# EAGLE design Čos - POC - rectifier and zero cross detector (EAGLE 9.6.2)
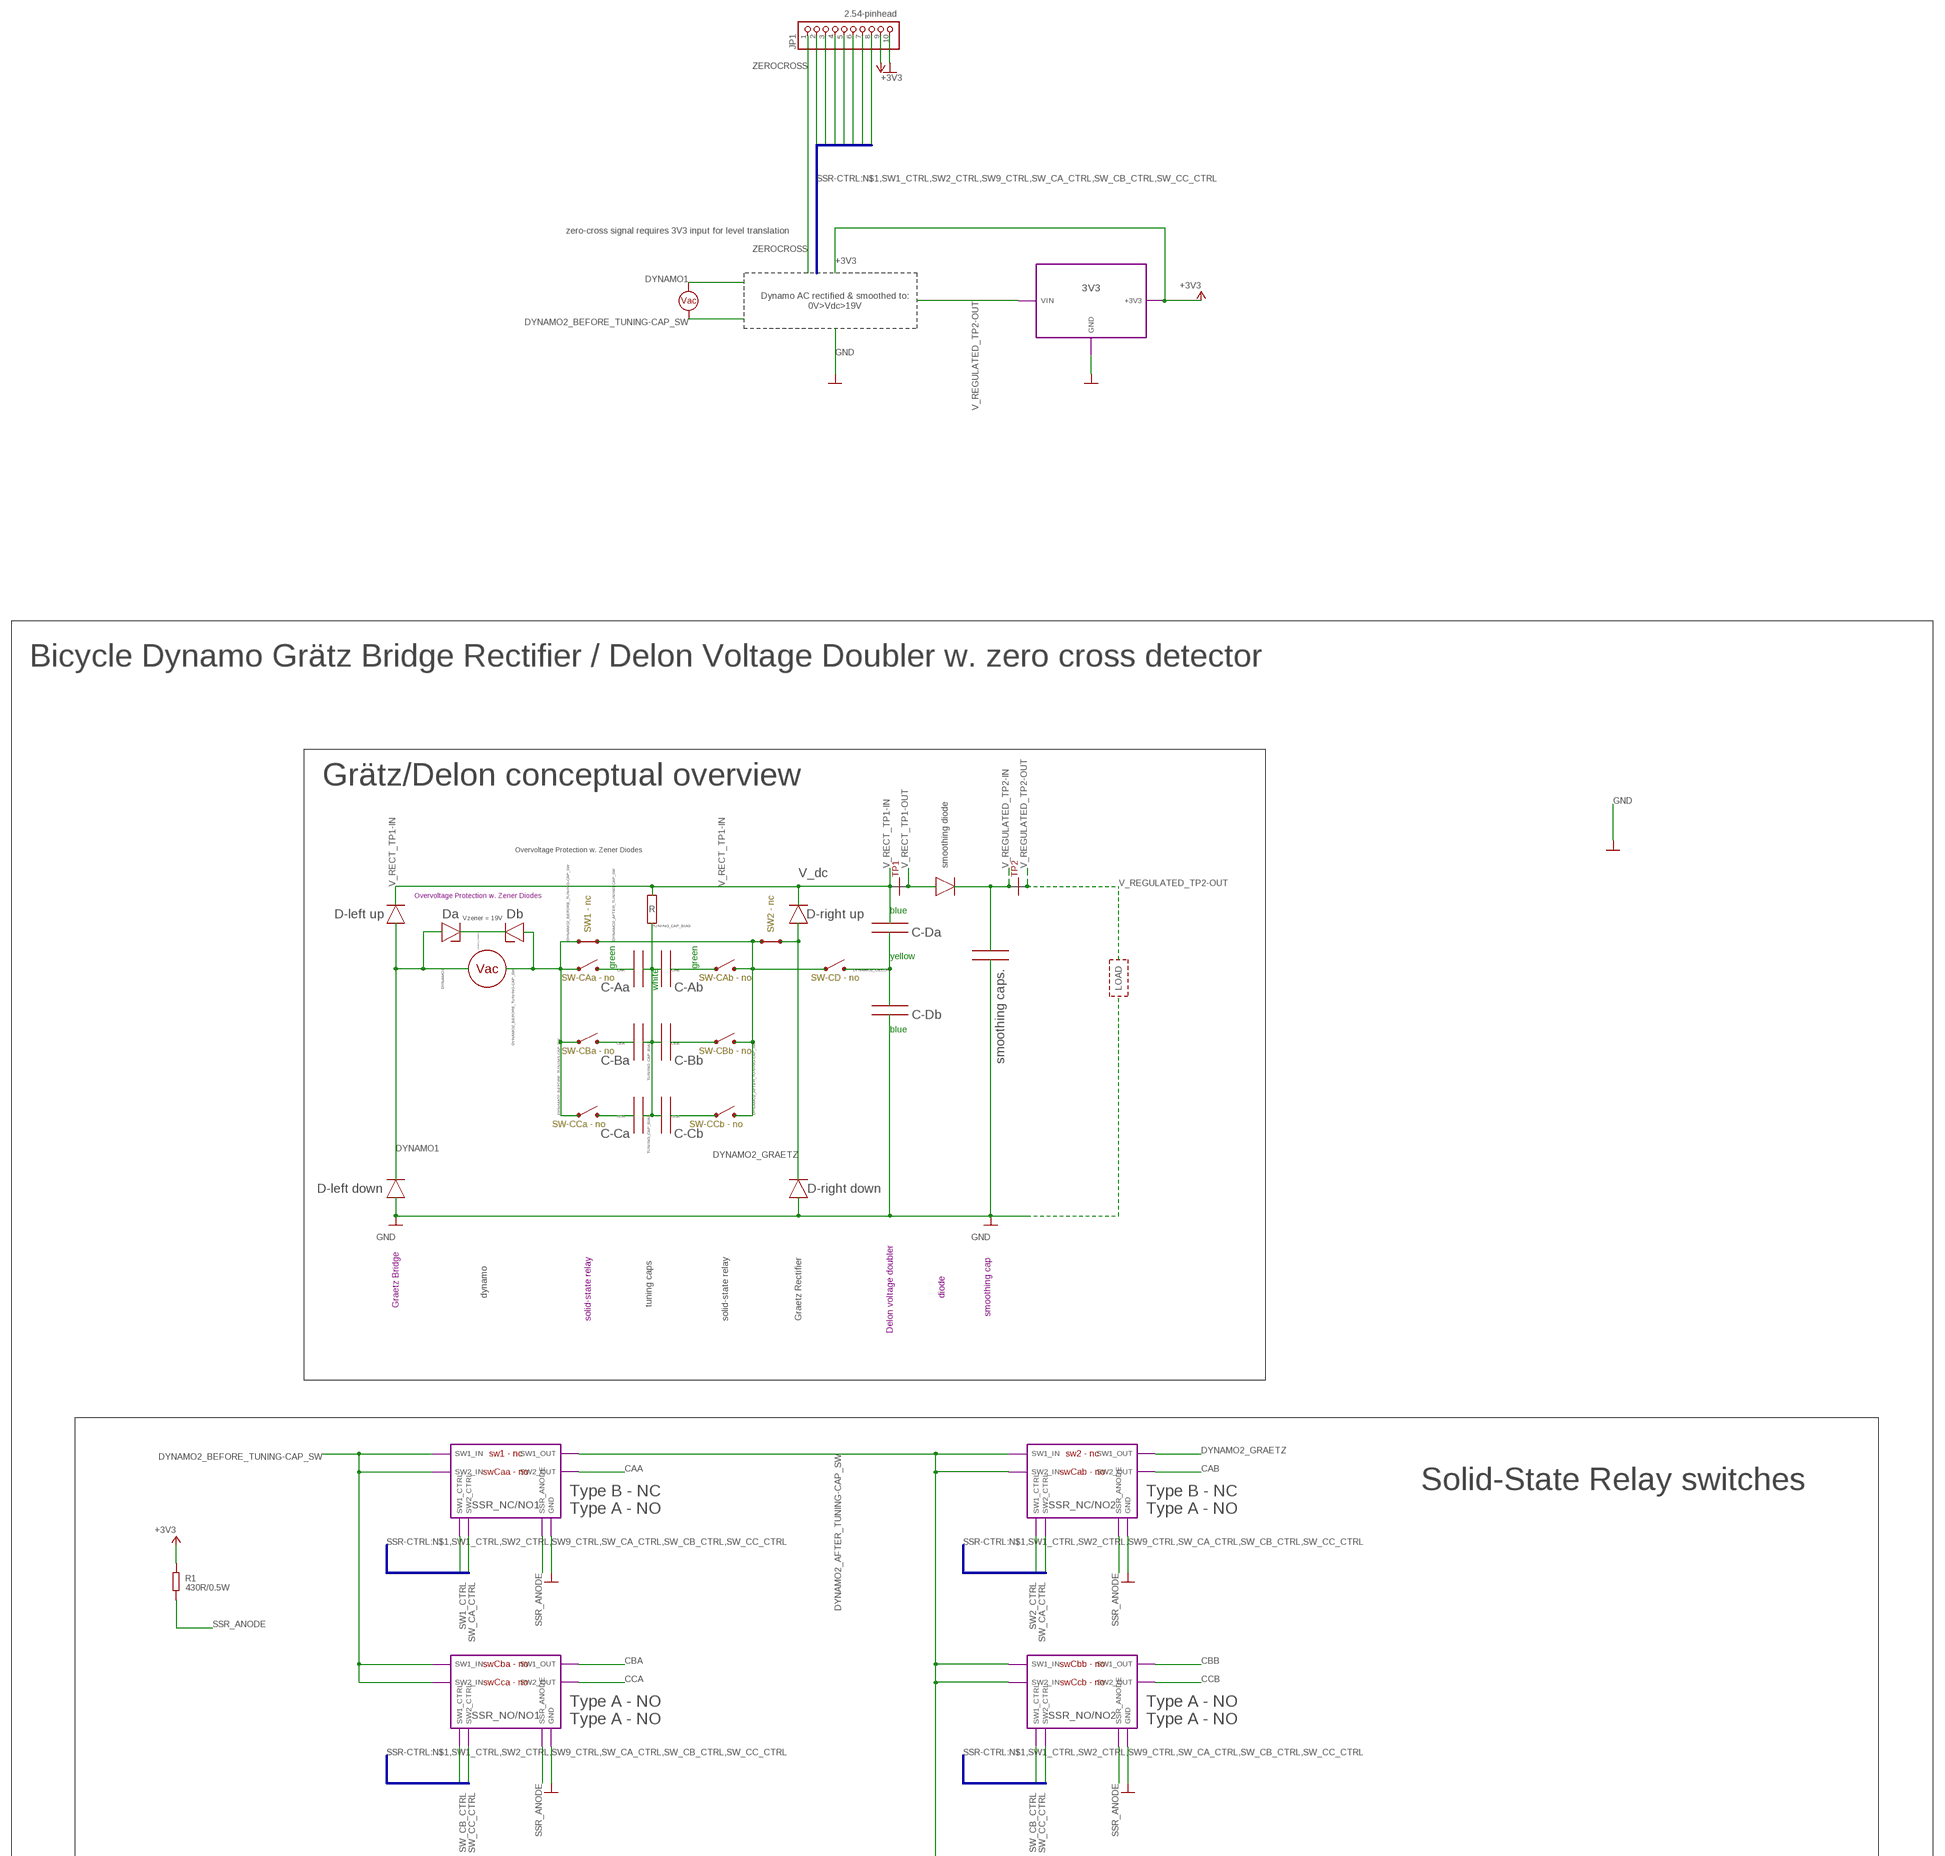
[diagram p0: schematic, sheet 1, part 1 of 3]
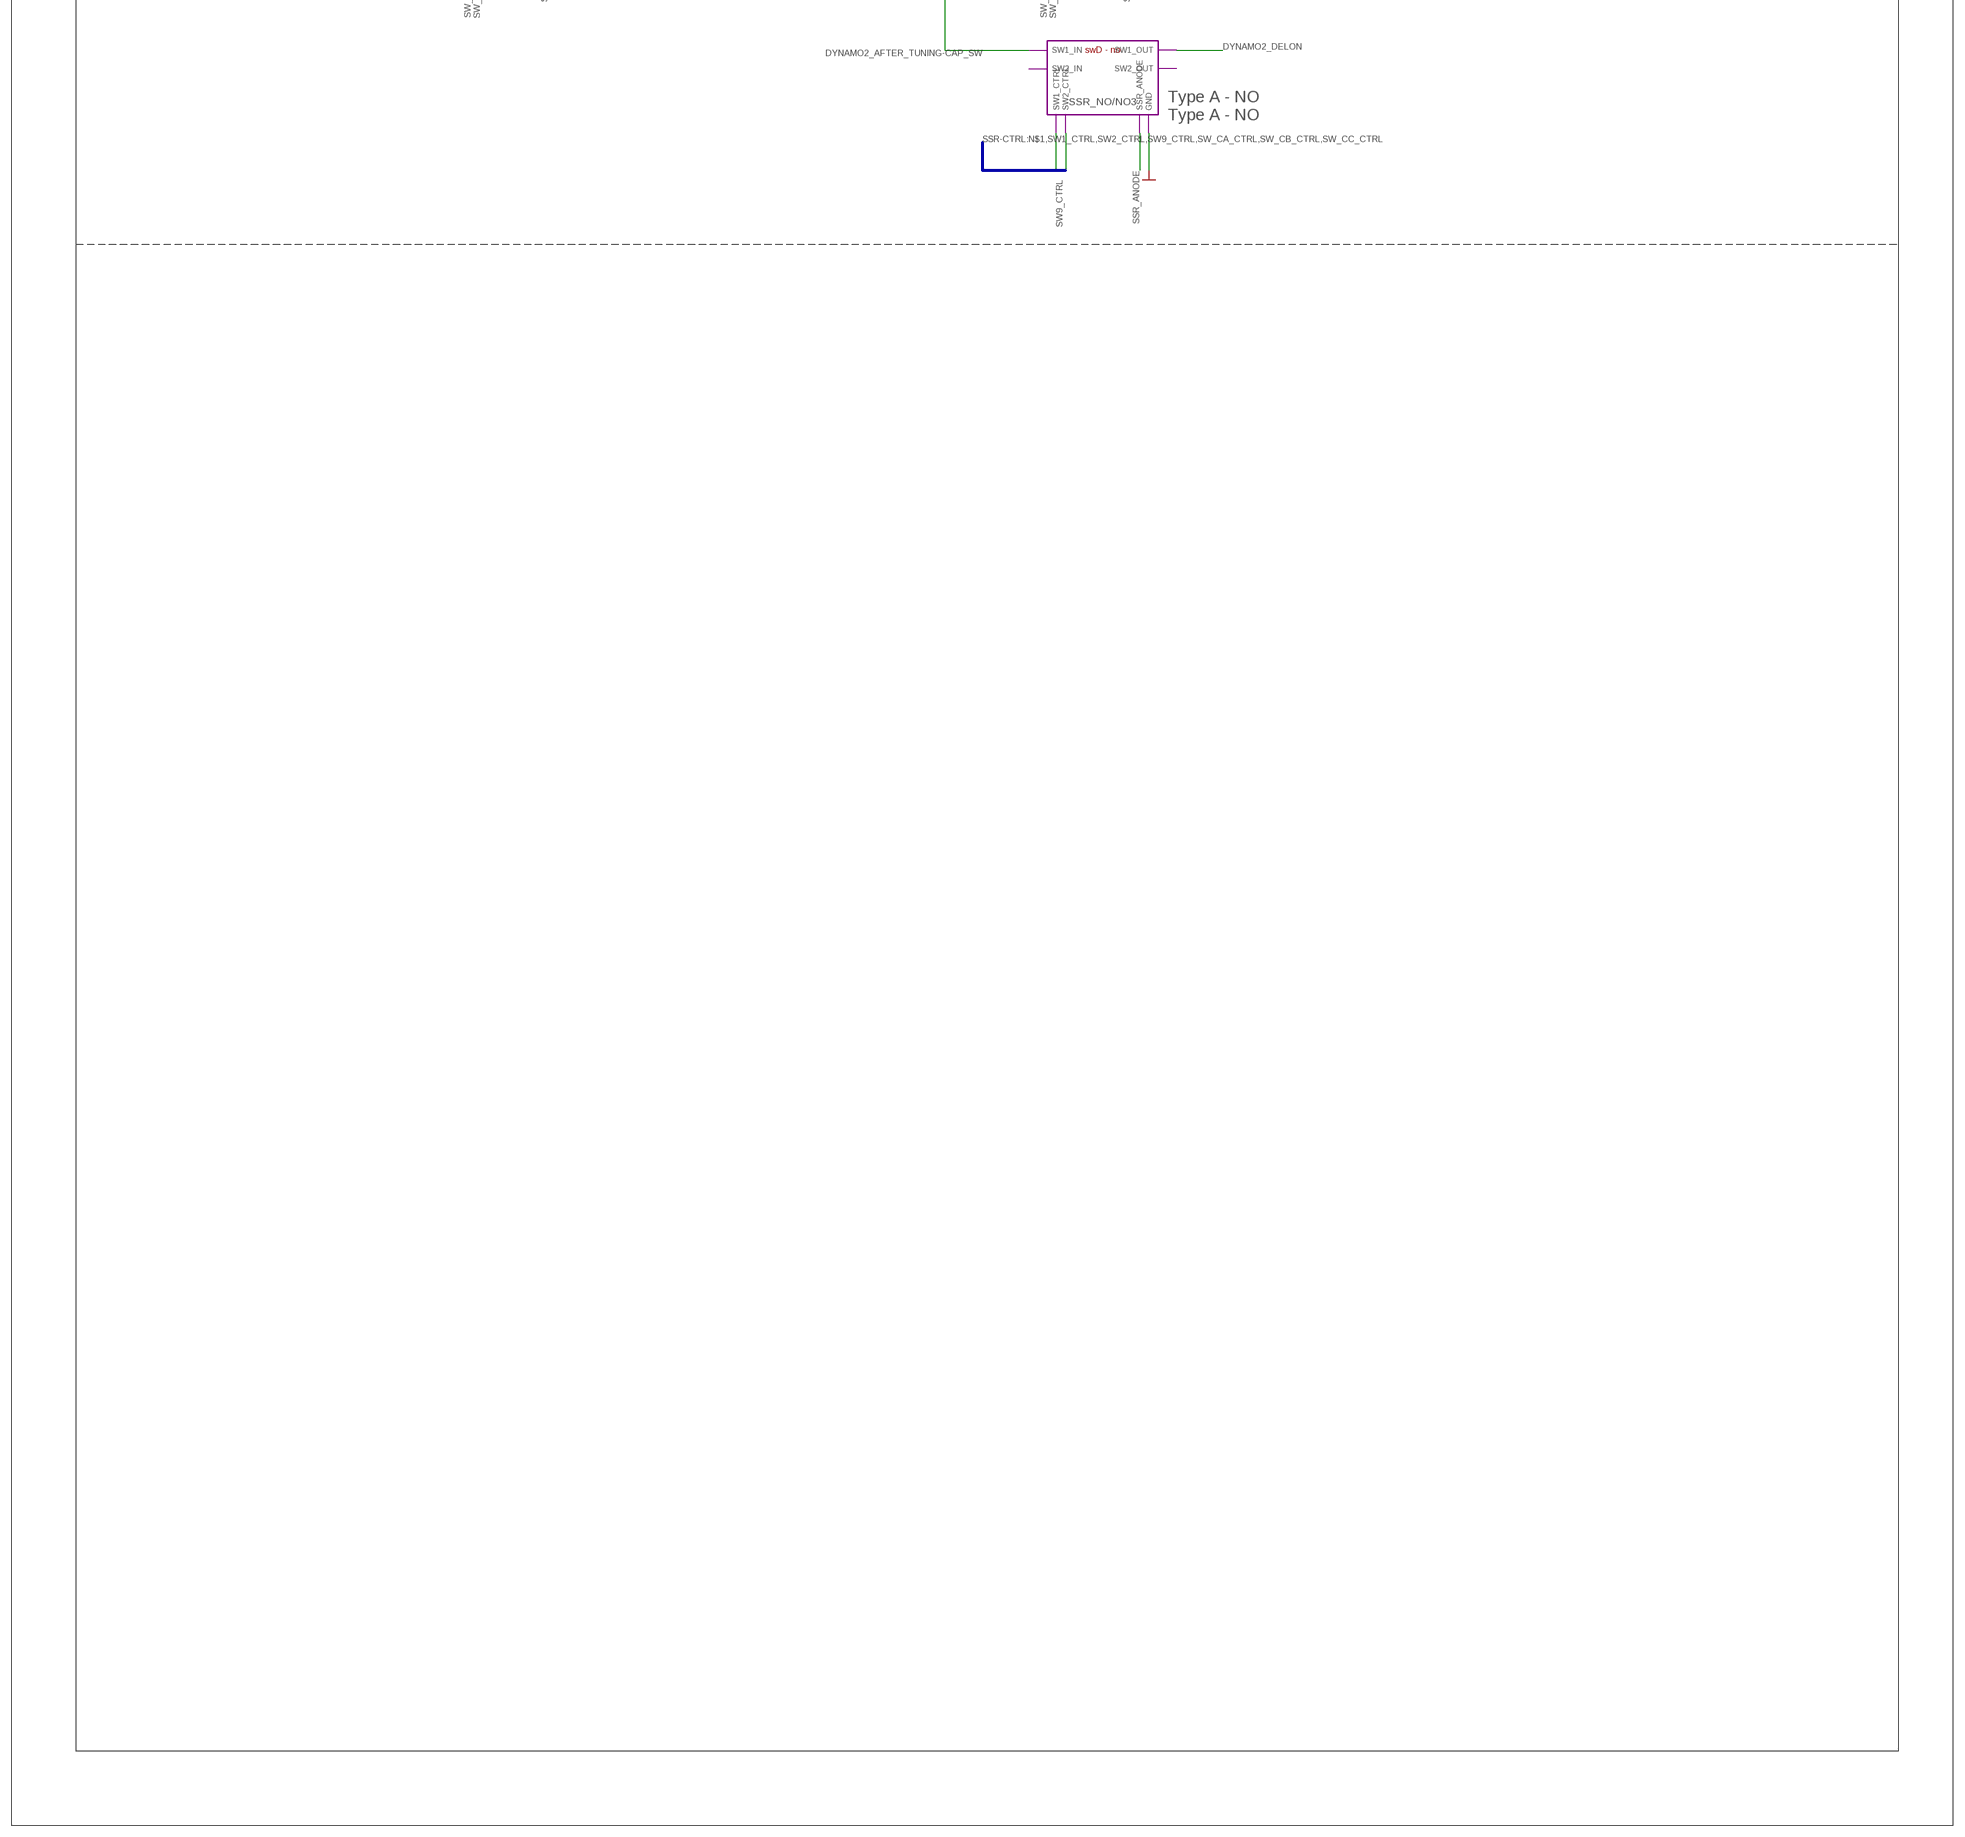
[diagram p1: schematic, sheet 1, part 2 of 3]
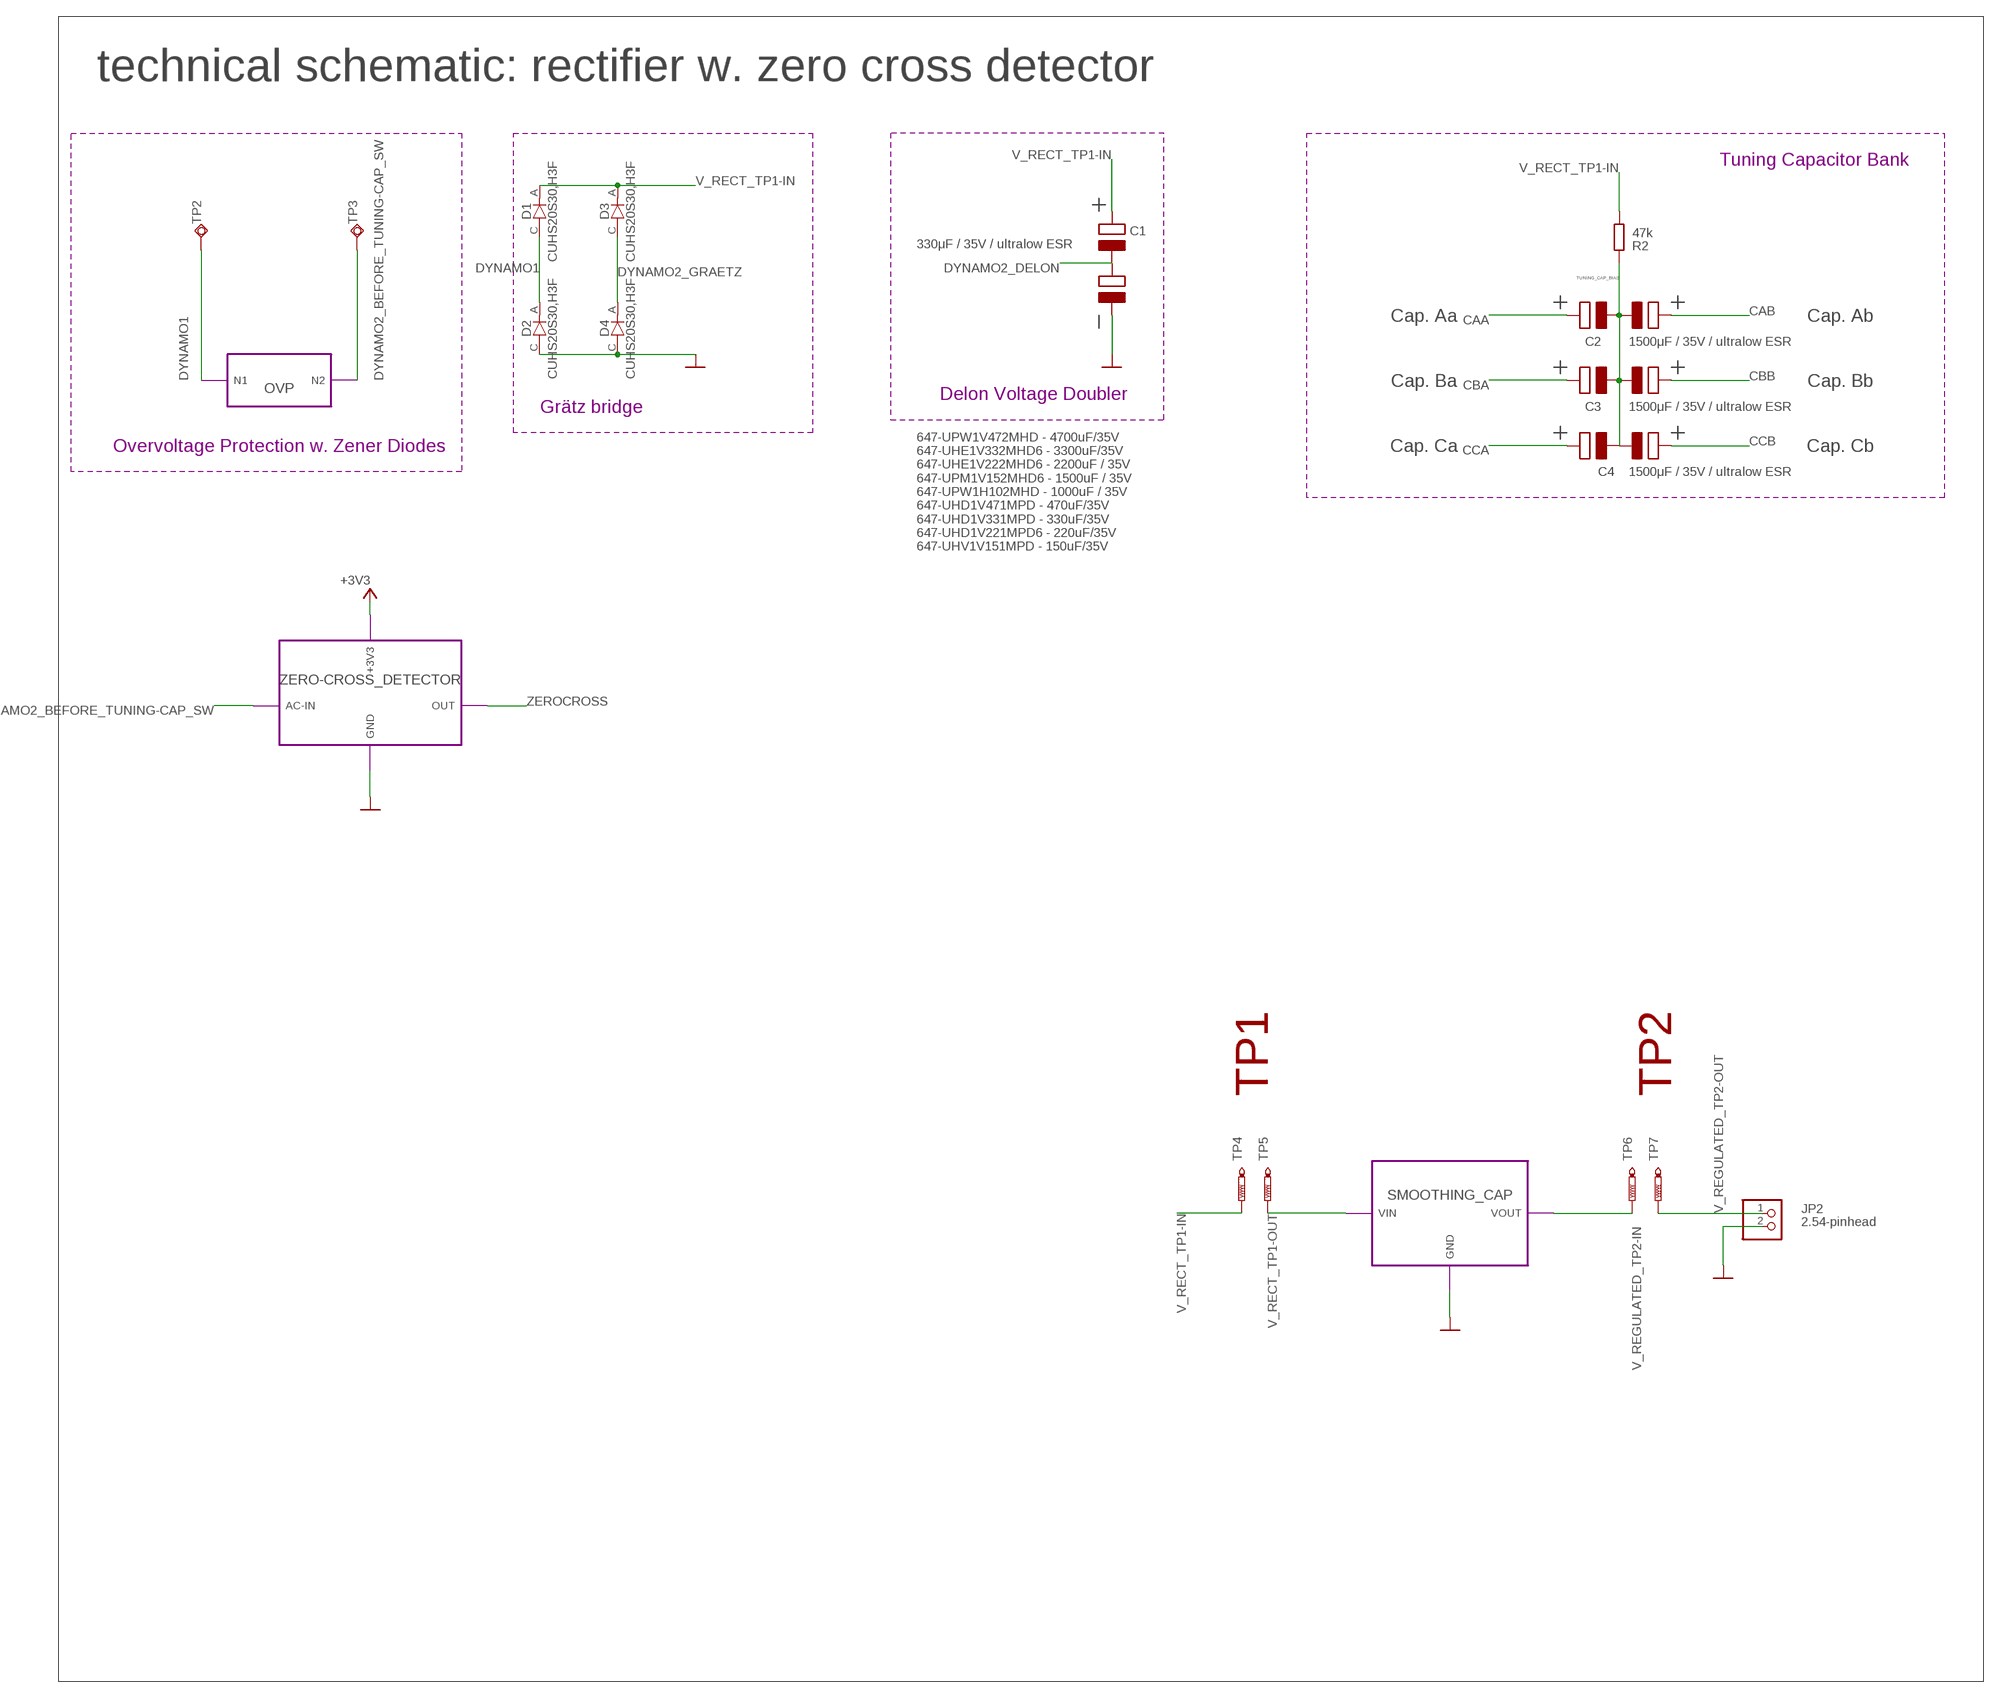
[diagram p2: schematic, sheet 1, part 3 of 3]

## Parts
C1  330μF / 35V / ultralow ESR  C-POL-2S  [TH-2S]
C2  1500μF / 35V / ultralow ESR  C-POL-2S-BACK-TO-BACK  [TH-2S-BACK-TO-BACK]
C3  1500μF / 35V / ultralow ESR  C-POL-2S-BACK-TO-BACK  [TH-2S-BACK-TO-BACK]
C4  1500μF / 35V / ultralow ESR  C-POL-2S-BACK-TO-BACK  [TH-2S-BACK-TO-BACK]
D1  CUHS20S30,H3F  CUHS20S30  [US2H]
D2  CUHS20S30,H3F  CUHS20S30  [US2H]
D3  CUHS20S30,H3F  CUHS20S30  [US2H]
D4  CUHS20S30,H3F  CUHS20S30  [US2H]
JP1  2.54-pinhead  PINHD-1X10  [1X10]
JP2  2.54-pinhead  PINHD-1X2  [1X02]
R1  430R/0.5W  R-EU_R0805  [R0805]
R2  47k  R-EU_R0805  [R0805]
TP2  dynamo 1  TPSQPAD1-13  [P1-13]
TP3  dynamo 2  TPSQPAD1-13  [P1-13]
TP4  TP1l  PTR1TP10SQ  [TP10SQ]
TP5  TP1r  PTR1TP10SQ  [TP10SQ]
TP6  TP2l  PTR1TP10SQ  [TP10SQ]
TP7  TP2r  PTR1TP10SQ  [TP10SQ]

## Module instances
ZERO-CROSS_DETECTOR = ZERO-CROSS_DETECTOR (part numbers offset by 700)
3V3 = 3V3 (part numbers offset by 900)
SMOOTHING_CAP = SMOOTHING_CAP (part numbers offset by 800)
SSR_NC/NO1 = SSR_NC/NO (part numbers offset by 100)
SSR_NC/NO2 = SSR_NC/NO (part numbers offset by 300)
SSR_NO/NO1 = SSR_NO/NO (part numbers offset by 200)
SSR_NO/NO2 = SSR_NO/NO (part numbers offset by 400)
SSR_NO/NO3 = SSR_NO/NO (part numbers offset by 500)
OVP = OVP (part numbers offset by 600)

## Nets
+3V3 [Vcc]: JP1.9 R1.2 ; port ZERO-CROSS_DETECTOR.+3V3 3V3.+3V3
CAA [DYNAMO_OUT]: C2.1_C ; port SSR_NC/NO1.SW2_OUT
CAB: C2.3_C(2_C) ; port SSR_NC/NO2.SW2_OUT
CBA [DYNAMO_OUT]: C3.1_C ; port SSR_NO/NO1.SW1_OUT
CBB [DYNAMO_OUT]: C3.3_C(2_C) ; port SSR_NO/NO2.SW1_OUT
CCA [DYNAMO_OUT]: C4.1_C ; port SSR_NO/NO1.SW2_OUT
CCB [DYNAMO_OUT]: C4.3_C(2_C) ; port SSR_NO/NO2.SW2_OUT
DYNAMO1 [DYNAMO_OUT]: D1.C D2.A TP2.TP ; port OVP.N1
DYNAMO2_AFTER_TUNING-CAP_SW [DYNAMO_OUT]: port SSR_NC/NO1.SW1_OUT SSR_NC/NO2.SW1_IN SSR_NC/NO2.SW2_IN SSR_NO/NO2.SW1_IN SSR_NO/NO2.SW2_IN SSR_NO/NO3.SW1_IN
DYNAMO2_BEFORE_TUNING-CAP_SW [DYNAMO_OUT]: TP3.TP ; port SSR_NC/NO1.SW1_IN SSR_NC/NO1.SW2_IN SSR_NO/NO1.SW1_IN SSR_NO/NO1.SW2_IN OVP.N2 ZERO-CROSS_DETECTOR.AC-IN
DYNAMO2_DELON [DYNAMO_OUT]: C1.2_MID(MID) ; port SSR_NO/NO3.SW1_OUT
DYNAMO2_GRAETZ [DYNAMO_OUT]: D3.C D4.A ; port SSR_NC/NO2.SW1_OUT
GND: C1.3_NEG(NEG) D2.C D4.C JP1.10 JP2.2 ; port 3V3.GND SMOOTHING_CAP.GND ZERO-CROSS_DETECTOR.GND SSR_NC/NO1.GND SSR_NC/NO2.GND SSR_NO/NO1.GND SSR_NO/NO2.GND SSR_NO/NO3.GND
N$1 [signal]: JP1.8 ; port SSR_NO/NO3.SW2_CTRL
SSR_ANODE: R1.1 ; port SSR_NC/NO1.SSR_ANODE SSR_NC/NO2.SSR_ANODE SSR_NO/NO1.SSR_ANODE SSR_NO/NO2.SSR_ANODE SSR_NO/NO3.SSR_ANODE
SW1_CTRL [signal]: JP1.2 ; port SSR_NC/NO1.SW1_CTRL
SW2_CTRL [signal]: JP1.3 ; port SSR_NC/NO2.SW1_CTRL
SW9_CTRL [signal]: JP1.7 ; port SSR_NO/NO3.SW1_CTRL
SW_CA_CTRL [signal]: JP1.4 ; port SSR_NC/NO2.SW2_CTRL SSR_NC/NO1.SW2_CTRL
SW_CB_CTRL [signal]: JP1.5 ; port SSR_NO/NO2.SW1_CTRL SSR_NO/NO1.SW1_CTRL
SW_CC_CTRL [signal]: JP1.6 ; port SSR_NO/NO2.SW2_CTRL SSR_NO/NO1.SW2_CTRL
TUNING_CAP_BIAS [DYNAMO_OUT]: C2.2_MID(MID) C3.2_MID(MID) C4.2_MID(MID) R2.1
V_RECT_TP1-IN [V_REGULATED]: C1.1_POS(POS) D1.A D3.A R2.2 TP4.TP
V_RECT_TP1-OUT [V_REGULATED]: TP5.TP ; port SMOOTHING_CAP.VIN
V_REGULATED_TP2-IN [Vcc]: TP6.TP ; port SMOOTHING_CAP.VOUT
V_REGULATED_TP2-OUT [Vcc]: JP2.1 TP7.TP ; port 3V3.VIN
ZEROCROSS [signal]: JP1.1 ; port ZERO-CROSS_DETECTOR.OUT

## Buses
SSR-CTRL:N$1,SW1_CTRL,SW2_CTRL,SW9_CTRL,SW_CA_CTRL,SW_CB_CTRL,SW_CC_CTRL

## Notes on the sheet
- zero-cross signal requires 3V3 input for level translation
- Vac
- Dynamo AC rectified & smoothed to:
  0V>Vdc>19V
- Bicycle Dynamo Grätz Bridge Rectifier / Delon Voltage Doubler w. zero cross detector
- Grätz/Delon conceptual overview
- Overvoltage Protection w. Zener Diodes
- smoothing diode
- V_dc | TP1 | TP2
- Overvoltage Protection w. Zener Diodes
- R
- D-left up | Da | Db | SW1 - nc | SW2 - nc | D-right up | blue
- Vzener = 19V
- C-Da
- yellow
- Vac | green | white | green | smoothing caps.
- SW-CAa - no | SW-CAb - no | SW-CD - no | LOAD
- C-Aa | C-Ab
- C-Db
- blue
- SW-CBa - no | SW-CBb - no
- C-Ba | C-Bb
- SW-CCa - no | SW-CCb - no
- C-Ca | C-Cb
- D-left down | D-right down
- Graetz Bridge
- solid-state relay | solid-state relay | Graetz Rectifier | Delon voltage doubler
- dynamo | diode
- tuning caps
- smoothing cap
- sw1 - nc | sw2 - nc
- swCaa - no | swCab - no
- Solid-State Relay switches
- Type B - NC
  Type A - NO
- Type B - NC
  Type A - NO
- swCba - no | swCbb - no
- swCca - no | swCcb - no | technical schematic: rectifier w. zero cross detector
- Type A - NO
  Type A - NO
- Type A - NO
  Type A - NO
- Tuning Capacitor Bank
- Cap. Aa | Cap. Ab
- swD - no
- Cap. Ba | Cap. Bb
- Delon Voltage Doubler
- Grätz bridge
- 647-UPW1V472MHD - 4700uF/35V
  647-UHE1V332MHD6 - 3300uF/35V
  647-UHE1V222MHD6 - 2200uF / 35V
  647-UPM1V152MHD6 - 1500uF / 35V
  647-UPW1H102MHD - 1000uF / 35V
  647-UHD1V471MPD - 470uF/35V
  647-UHD1V331MPD - 330uF/35V
  647-UHD1V221MPD6 - 220uF/35V
  647-UHV1V151MPD - 150uF/35V
- Type A - NO
  Type A - NO
- Overvoltage Protection w. Zener Diodes | Cap. Ca | Cap. Cb
- TP1 | TP2

## Library data of the parts
C1 = C-Pol:C-POL-2S
C2-C4 = C-Pol:C-POL-2S-BACK-TO-BACK
D1-D4 = CUHS20S30 - Schottky Barrier Diode:CUHS20S30
JP1 = pinhead:PINHD-1X10: PIN HEADER
JP2 = pinhead:PINHD-1X2: PIN HEADER
R1 R2 = rcl:R-EU_: RESISTOR, European symbol; SPICEPREFIX: R
TP2 TP3 = testpad:TPSQ: Test pad
TP4-TP7 = testpad:PTR1: TEST PIN

## Module ZERO-CROSS_DETECTOR
Ports: GND(pwr) +3V3(pwr) AC-IN(in) OUT(out)
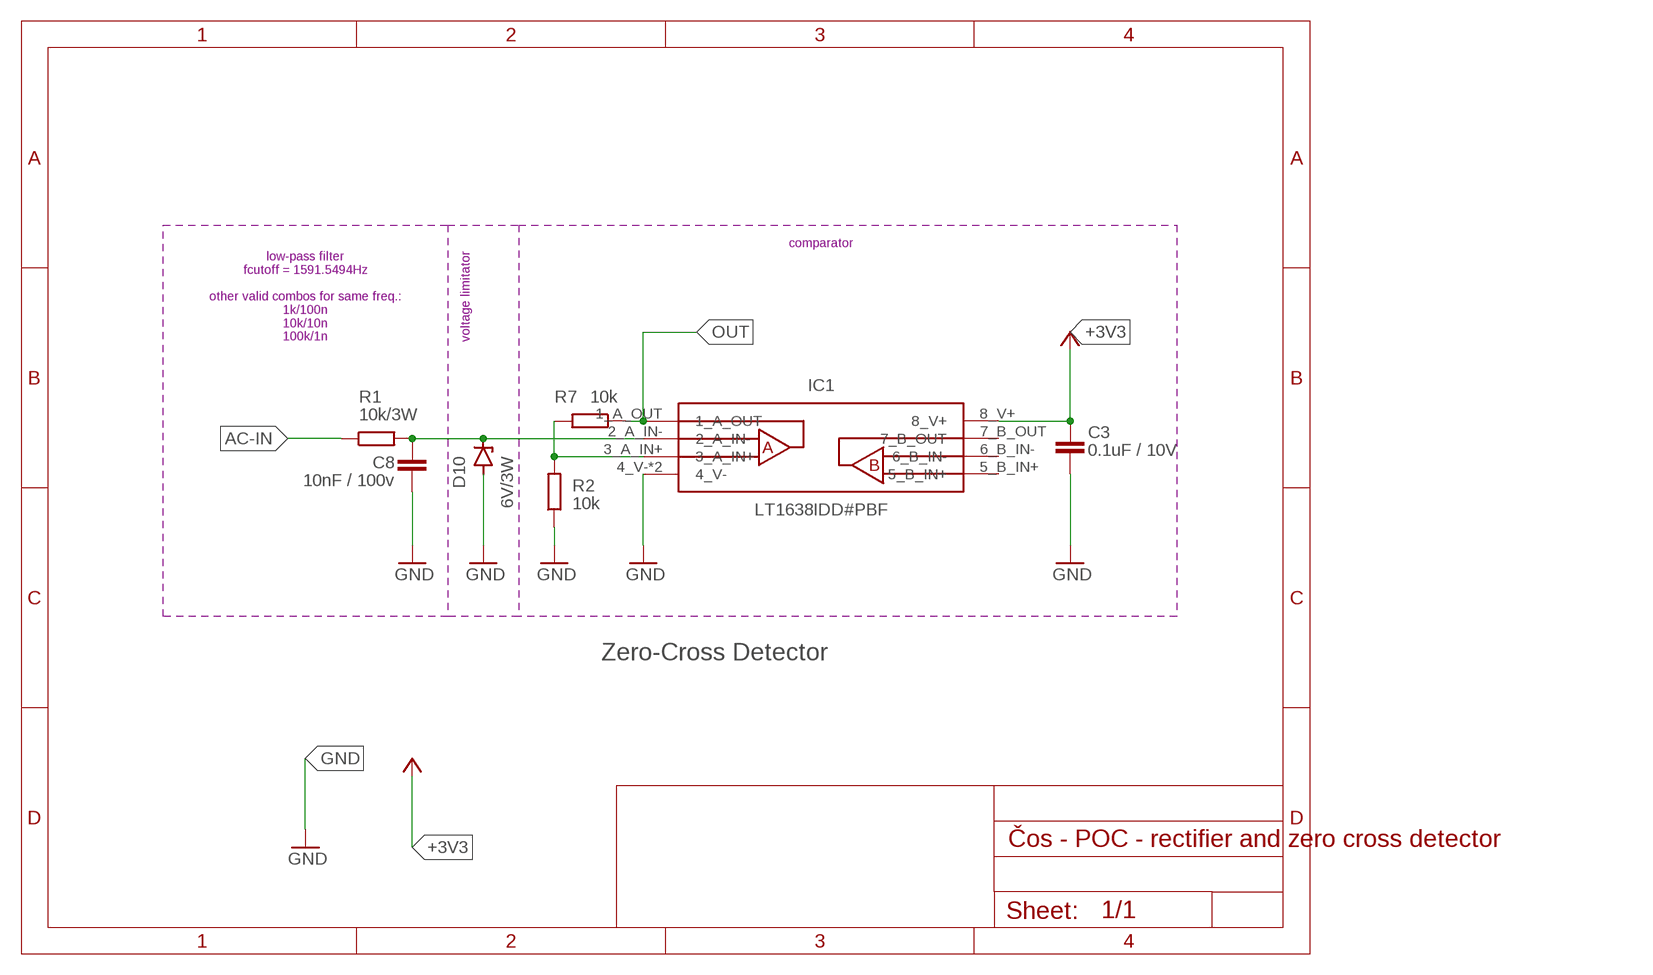
[diagram p3: schematic, module ZERO-CROSS_DETECTOR, sheet 1]

### Parts
C3  0.1uF / 10V  C-EUC0805  [C0805]
C8  10nF / 100v  C-EUC1812  [C1812]
D10  6V/3W  ZENER-DIODEDO214AA  [DO214AA]
IC1  LT1638IDD#PBF  LT1638  [DFN-8]
R1  10k/3W  R-EU_R2512  [R2512]
R2  10k  R-EU_R0805  [R0805]
R7  10k  R-EU_R0805  [R0805]

### Nets
+3V3 [Vcc]: C3.2 IC1.8_V+
AC-IN [DYNAMO_OUT]: R1.1
GND: C3.1 C8.1 D10.A IC1.4_V- IC1.9_V-(4_V-) R2.1
N$6 [Vcc]: C8.2 D10.C IC1.2_A_IN- R1.2
N$12: IC1.3_A_IN+ R2.2 R7.2
OUT [signal]: IC1.1_A_OUT R7.1
Unconnected: IC1.5_B_IN+ IC1.6_B_IN- IC1.7_B_OUT

### Notes on the sheet
- comparator
- low-pass filter
  fcutoff = 1591.5494Hz
  
  other valid combos for same freq.:
  1k/100n
  10k/10n
  100k/1n
- voltage limitator
- Zero-Cross Detector

### Library data of the parts
C3 C8 = rcl:C-EU: CAPACITOR, European symbol; SPICEPREFIX: C
D10 = diode:ZENER-DIODE: Z-Diode
IC1 = LT1638 - Rail to Rail OpAmp:LT1638
R1 R2 R7 = rcl:R-EU_: RESISTOR, European symbol; SPICEPREFIX: R

## Module 3V3
Ports: GND(pwr) +3V3(pwr) VIN(pwr)
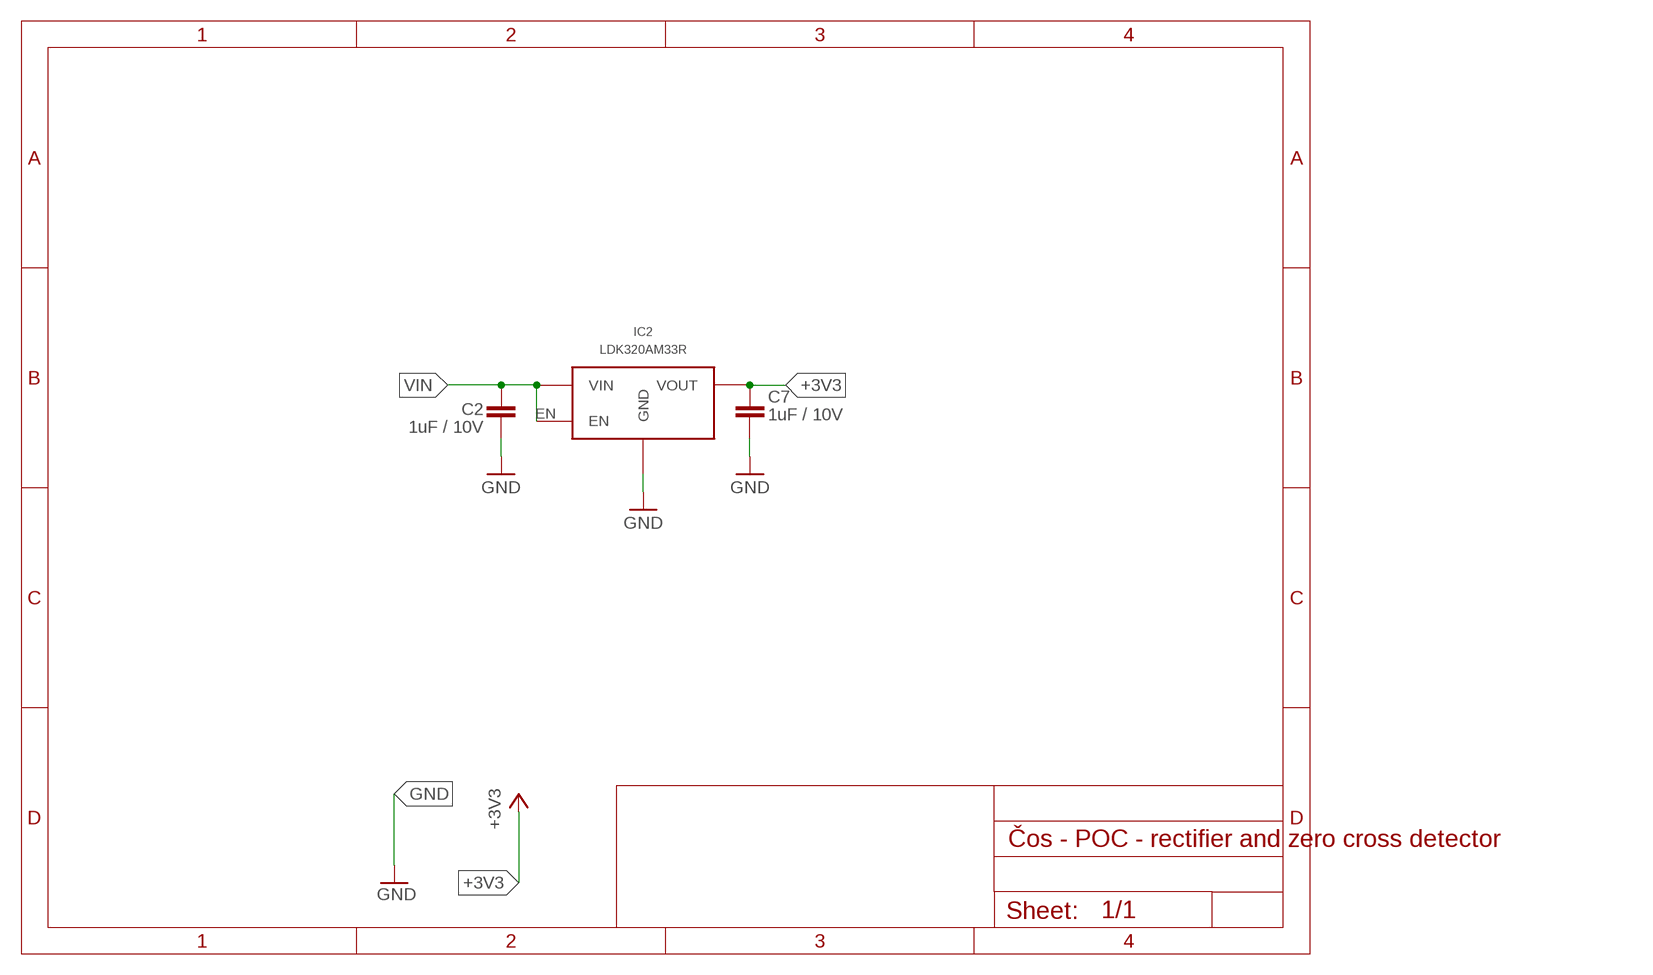
[diagram p4: schematic, module 3V3, sheet 1]

### Parts
C2  1uF / 10V  C-EUC0805  [C0805]
C7  1uF / 10V  C-EUC0805  [C0805]
IC2  LDK320AM33R  LDK320SOT-23-5L  [SOT-23-5L]

### Nets
+3V3 [Vcc]: C7.2 IC2.OUT(VOUT)
GND: C2.2 C7.1 IC2.GND
VIN [DYNAMO_OUT]: C2.1 IC2.EN IC2.IN(VIN)

### Library data of the parts
C2 C7 = rcl:C-EU: CAPACITOR, European symbol; SPICEPREFIX: C
IC2 = LDK320 5V LDO:LDK320

## Module SMOOTHING_CAP
Ports: GND(io) VIN(pwr) VOUT(pwr)
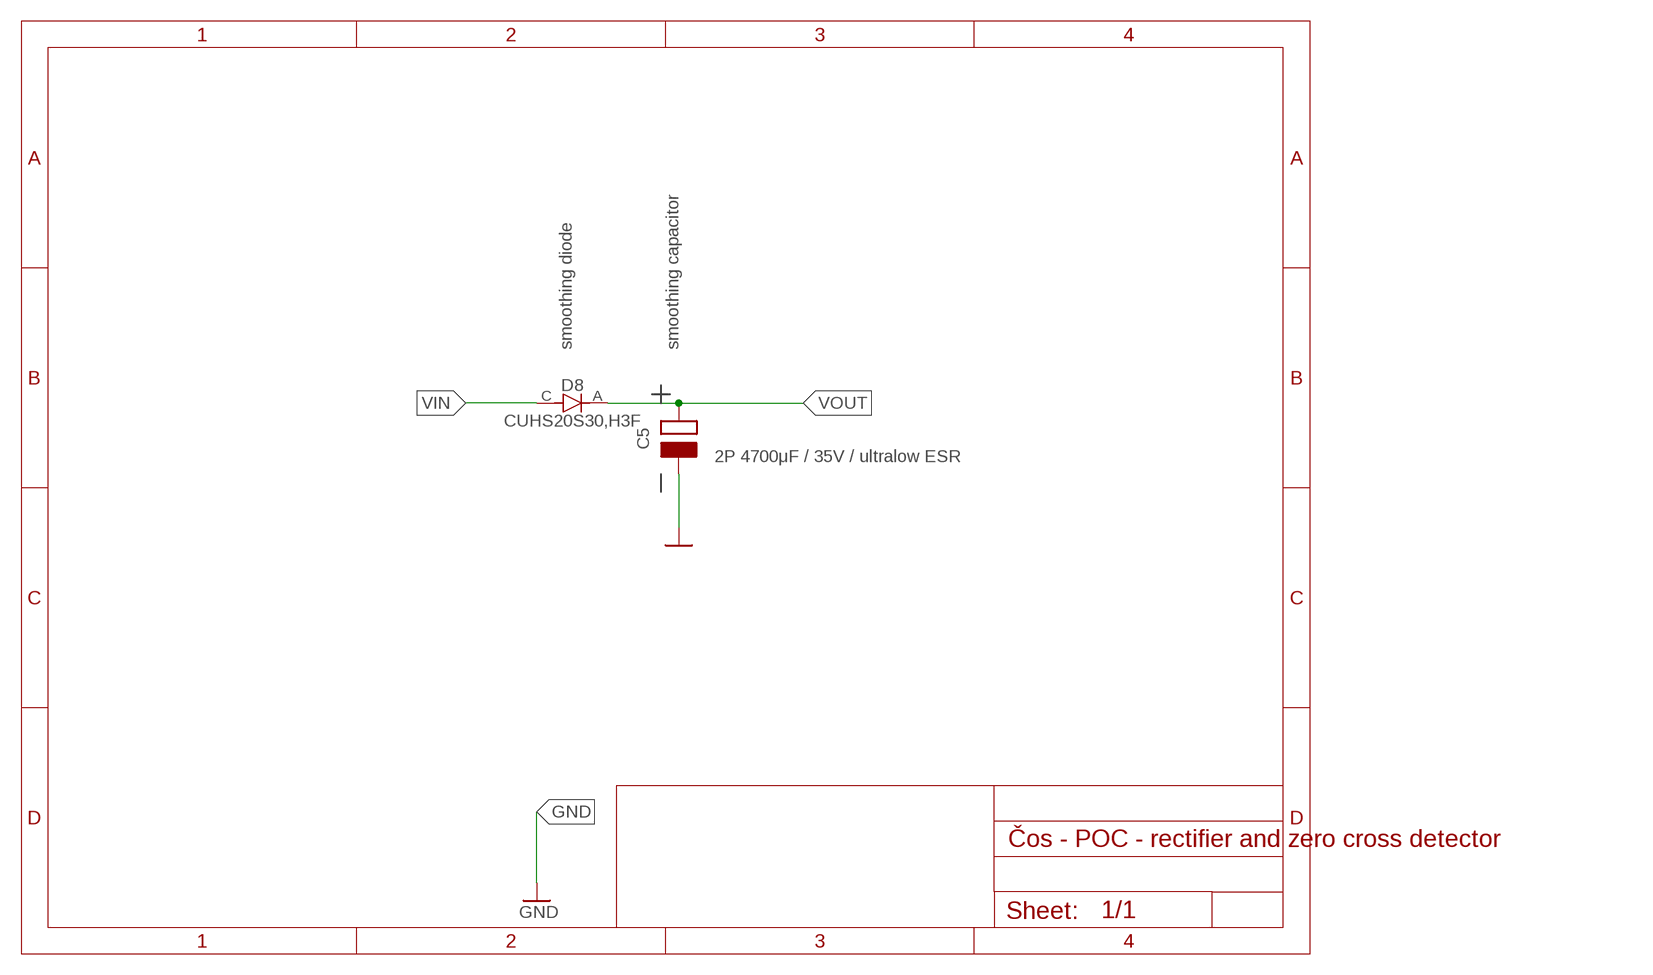
[diagram p5: schematic, module SMOOTHING_CAP, sheet 1]

### Parts
C5  2P 4700μF / 35V / ultralow ESR  C-POL  [TH]
D8  CUHS20S30,H3F  CUHS20S30  [US2H]

### Nets
GND: C5.NEG
VIN [V_REGULATED]: D8.C
VOUT [Vcc]: C5.POS D8.A

### Notes on the sheet
- smoothing diode | smoothing capacitor

### Library data of the parts
C5 = C-Pol:C-POL
D8 = CUHS20S30 - Schottky Barrier Diode:CUHS20S30

## Module SSR_NC/NO
Ports: SSR_ANODE(pwr) GND(pwr) SW2_CTRL(in) SW1_CTRL(in) SW1_IN(hiz) SW2_IN(hiz) SW1_OUT(hiz) SW2_OUT(hiz)
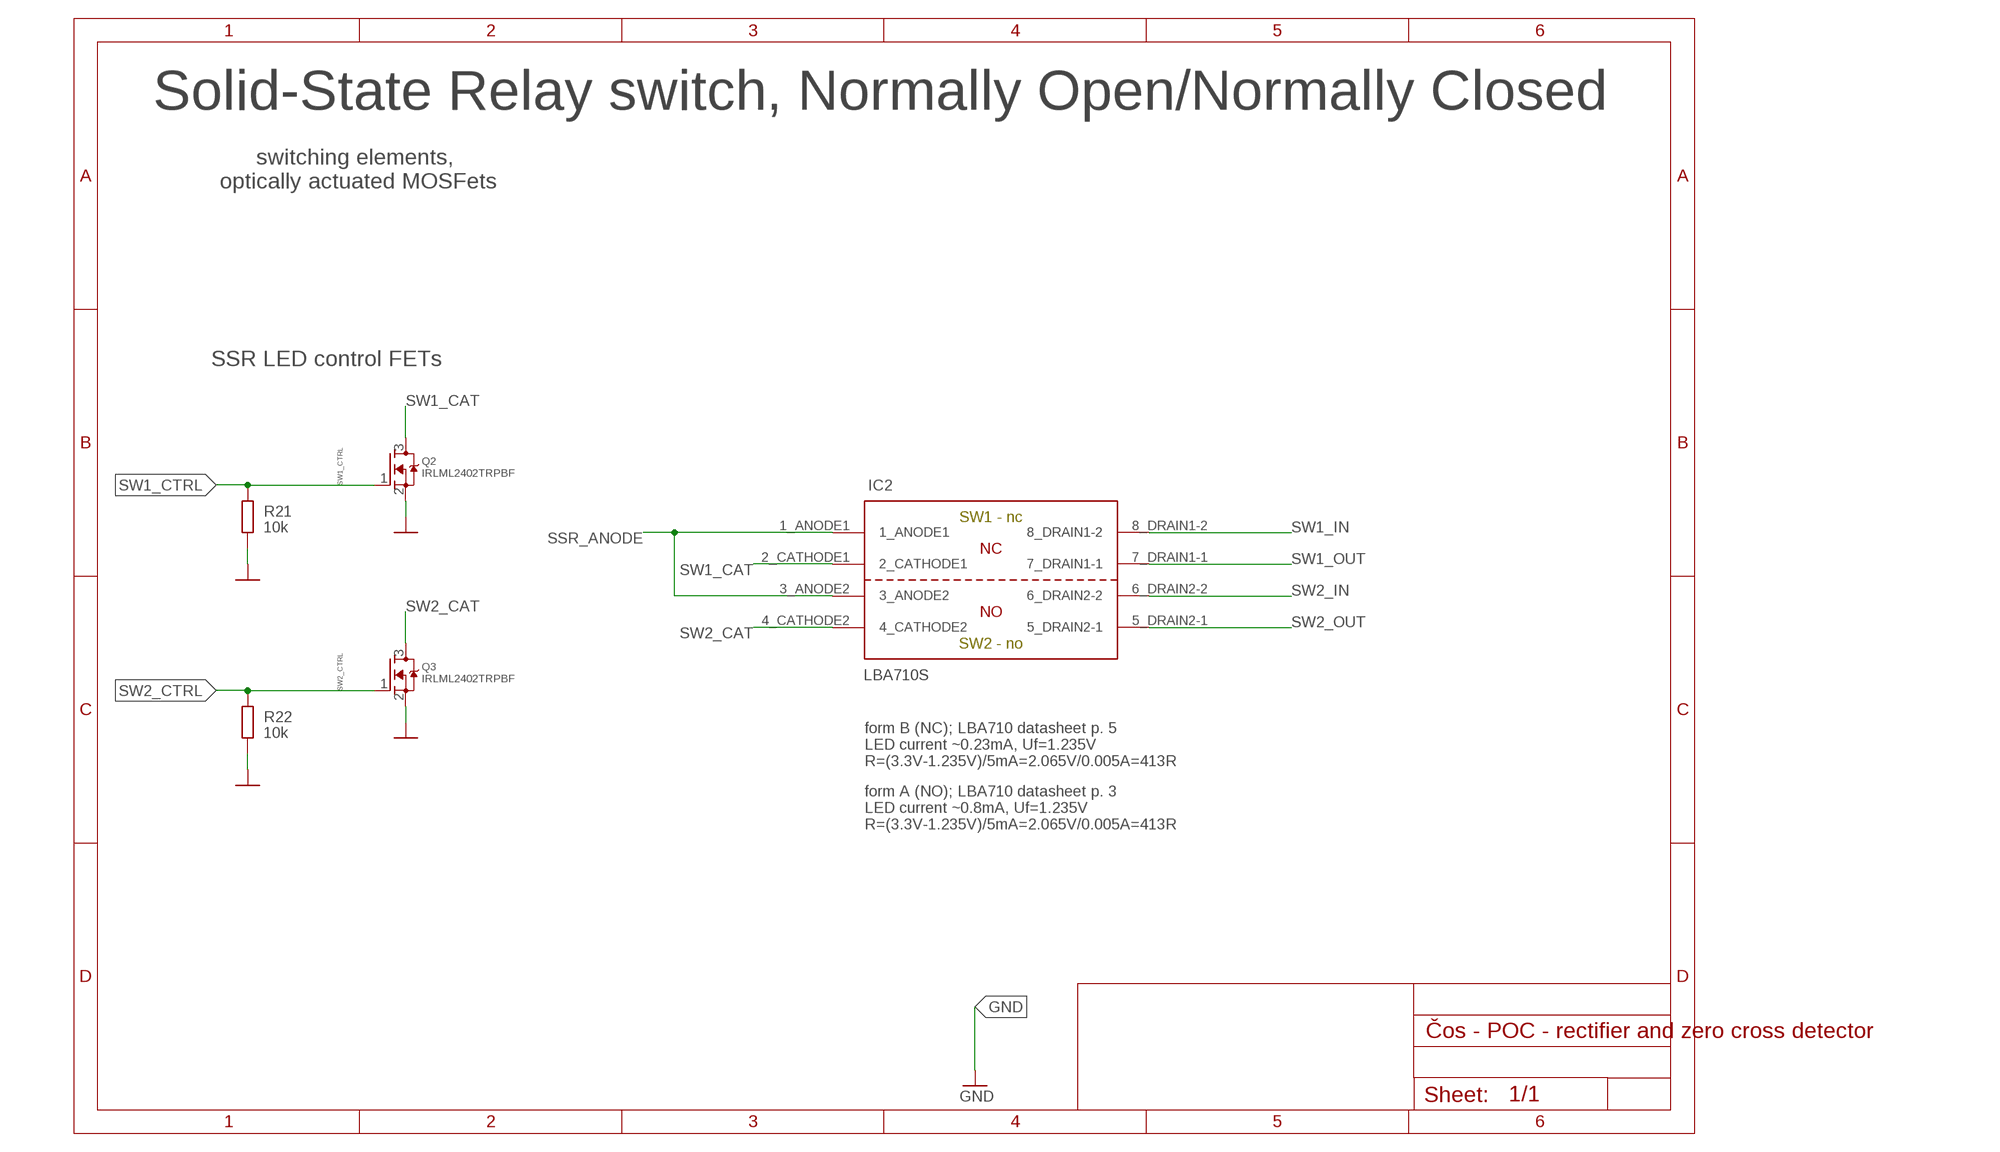
[diagram p6: schematic, module SSR_NC/NO, sheet 1]

### Parts
IC2  LBA710S  LBA710  [SMD_DIP8]
Q2  IRLML2402TRPBF  MOSFET-NREFLOW  [SOT23]
Q3  IRLML2402TRPBF  MOSFET-NREFLOW  [SOT23]
R21  10k  R-EU_R0805  [R0805]
R22  10k  R-EU_R0805  [R0805]

### Nets
GND: Q2.2(S) Q3.2(S) R21.2 R22.2
SSR_ANODE: IC2.1_ANODE1 IC2.3_ANODE2
SW1_CAT [signal]: IC2.2_CATHODE1 Q2.3(D)
SW1_CTRL [signal]: Q2.1(G) R21.1
SW1_IN [DYNAMO_OUT]: IC2.8_DRAIN1-2
SW1_OUT [DYNAMO_OUT]: IC2.7_DRAIN1-1
SW2_CAT [signal]: IC2.4_CATHODE2 Q3.3(D)
SW2_CTRL [signal]: Q3.1(G) R22.1
SW2_IN [DYNAMO_OUT]: IC2.6_DRAIN2-2
SW2_OUT [DYNAMO_OUT]: IC2.5_DRAIN2-1

### Notes on the sheet
- Solid-State Relay switch, Normally Open/Normally Closed
- switching elements, 
  optically actuated MOSFets
- SSR LED control FETs
- SW1 - nc
- SW2 - no
- form B (NC); LBA710 datasheet p. 5
  LED current ~0.23mA, Uf=1.235V
  R=(3.3V-1.235V)/5mA=2.065V/0.005A=413R
- form A (NO); LBA710 datasheet p. 3
  LED current ~0.8mA, Uf=1.235V
  R=(3.3V-1.235V)/5mA=2.065V/0.005A=413R

### Library data of the parts
IC2 = LxA710 - Solid State Relay Form A-AB:LBA710
Q2 Q3 = adafruit:MOSFET-N: N-Channel Mosfet 2N7002E - 60V 260mA SOT23 [Digikey: 2N7002ET1GOSTR-ND] - REEL BSH103 - 30V 850mA SOT23 [Digikey: 568-5013-1-ND]
R21 R22 = rcl:R-EU_: RESISTOR, European symbol; SPICEPREFIX: R

## Module SSR_NO/NO
Ports: GND(pwr) SSR_ANODE(pwr) SW2_CTRL(in) SW1_CTRL(in) SW1_IN(hiz) SW1_OUT(hiz) SW2_IN(hiz) SW2_OUT(hiz)
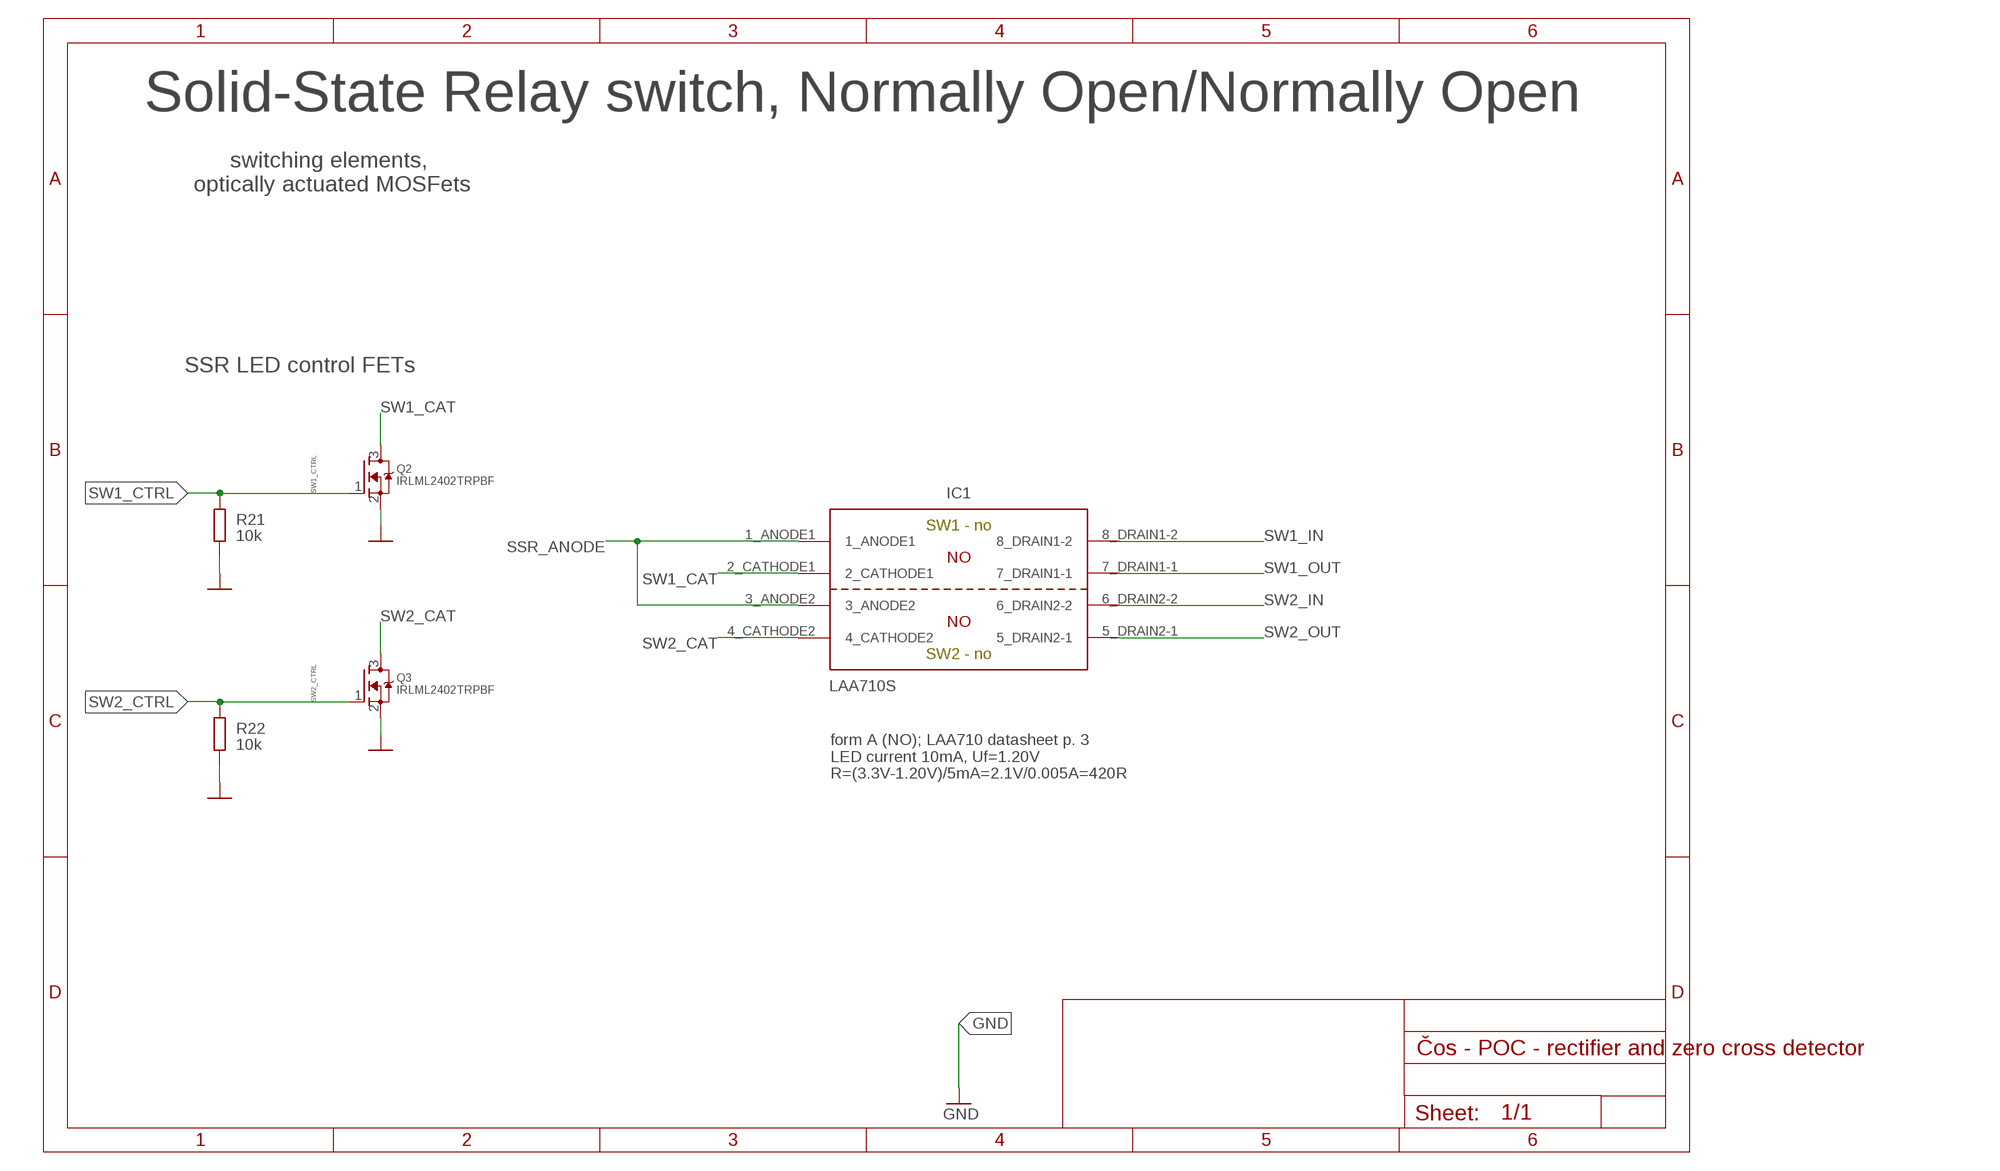
[diagram p7: schematic, module SSR_NO/NO, sheet 1]

### Parts
IC1  LAA710S  LAA710  [SMD_DIP8]
Q2  IRLML2402TRPBF  MOSFET-NREFLOW  [SOT23]
Q3  IRLML2402TRPBF  MOSFET-NREFLOW  [SOT23]
R21  10k  R-EU_R0805  [R0805]
R22  10k  R-EU_R0805  [R0805]

### Nets
GND: Q2.2(S) Q3.2(S) R21.2 R22.2
SSR_ANODE: IC1.1_ANODE1 IC1.3_ANODE2
SW1_CAT [signal]: IC1.2_CATHODE1 Q2.3(D)
SW1_CTRL [signal]: Q2.1(G) R21.1
SW1_IN [DYNAMO_OUT]: IC1.8_DRAIN1-2
SW1_OUT [DYNAMO_OUT]: IC1.7_DRAIN1-1
SW2_CAT [signal]: IC1.4_CATHODE2 Q3.3(D)
SW2_CTRL [signal]: Q3.1(G) R22.1
SW2_IN [DYNAMO_OUT]: IC1.6_DRAIN2-2
SW2_OUT [DYNAMO_OUT]: IC1.5_DRAIN2-1

### Notes on the sheet
- Solid-State Relay switch, Normally Open/Normally Open
- switching elements, 
  optically actuated MOSFets
- SSR LED control FETs
- SW1 - no
- SW2 - no
- form A (NO); LAA710 datasheet p. 3
  LED current 10mA, Uf=1.20V
  R=(3.3V-1.20V)/5mA=2.1V/0.005A=420R

### Library data of the parts
IC1 = LxA710 - Solid State Relay Form A-AB:LAA710
Q2 Q3 = adafruit:MOSFET-N: N-Channel Mosfet 2N7002E - 60V 260mA SOT23 [Digikey: 2N7002ET1GOSTR-ND] - REEL BSH103 - 30V 850mA SOT23 [Digikey: 568-5013-1-ND]
R21 R22 = rcl:R-EU_: RESISTOR, European symbol; SPICEPREFIX: R

## Module OVP
Ports: N1(pas) N2(pas)
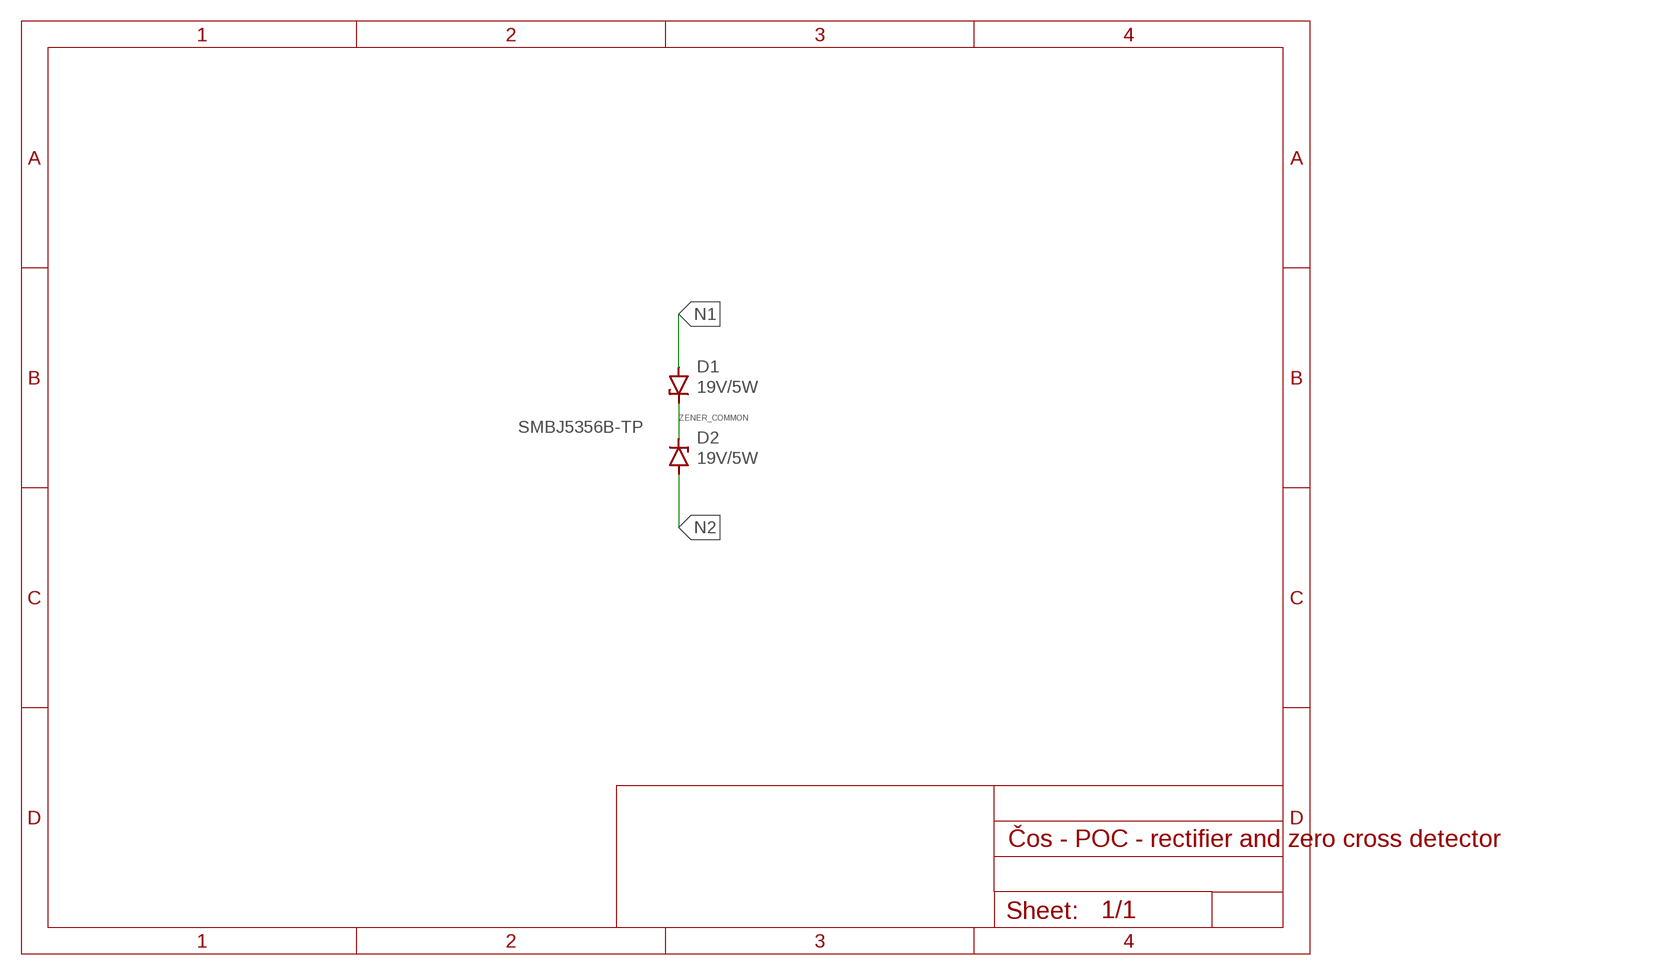
[diagram p8: schematic, module OVP, sheet 1]

### Parts
D1  19V/5W  ZENER-DIODEDO214AA  [DO214AA]
D2  19V/5W  ZENER-DIODEDO214AA  [DO214AA]

### Nets
N1 [DYNAMO_OUT]: D1.A
N2 [DYNAMO_OUT]: D2.A
ZENER_COMMON [DYNAMO_OUT]: D1.C D2.C

### Notes on the sheet
- SMBJ5356B-TP

### Library data of the parts
D1 D2 = diode:ZENER-DIODE: Z-Diode

## Net classes
0 GND: width 0.5 mm, drill 0.3 mm, clearance 0.2 mm
1 DYNAMO_OUT: width 0.5 mm, drill 0.3 mm, clearance 0.2 mm
2 V_DC: width 0.3 mm, drill 0.3 mm, clearance 0.2 mm
3 V_REGULATED: width 0.3 mm, drill 0.3 mm, clearance 0.2 mm
4 Vcc: width 0.3 mm, drill 0.3 mm, clearance 0.2 mm
5 signal: width 0.3 mm, drill 0.3 mm, clearance 0.2 mm

## Board
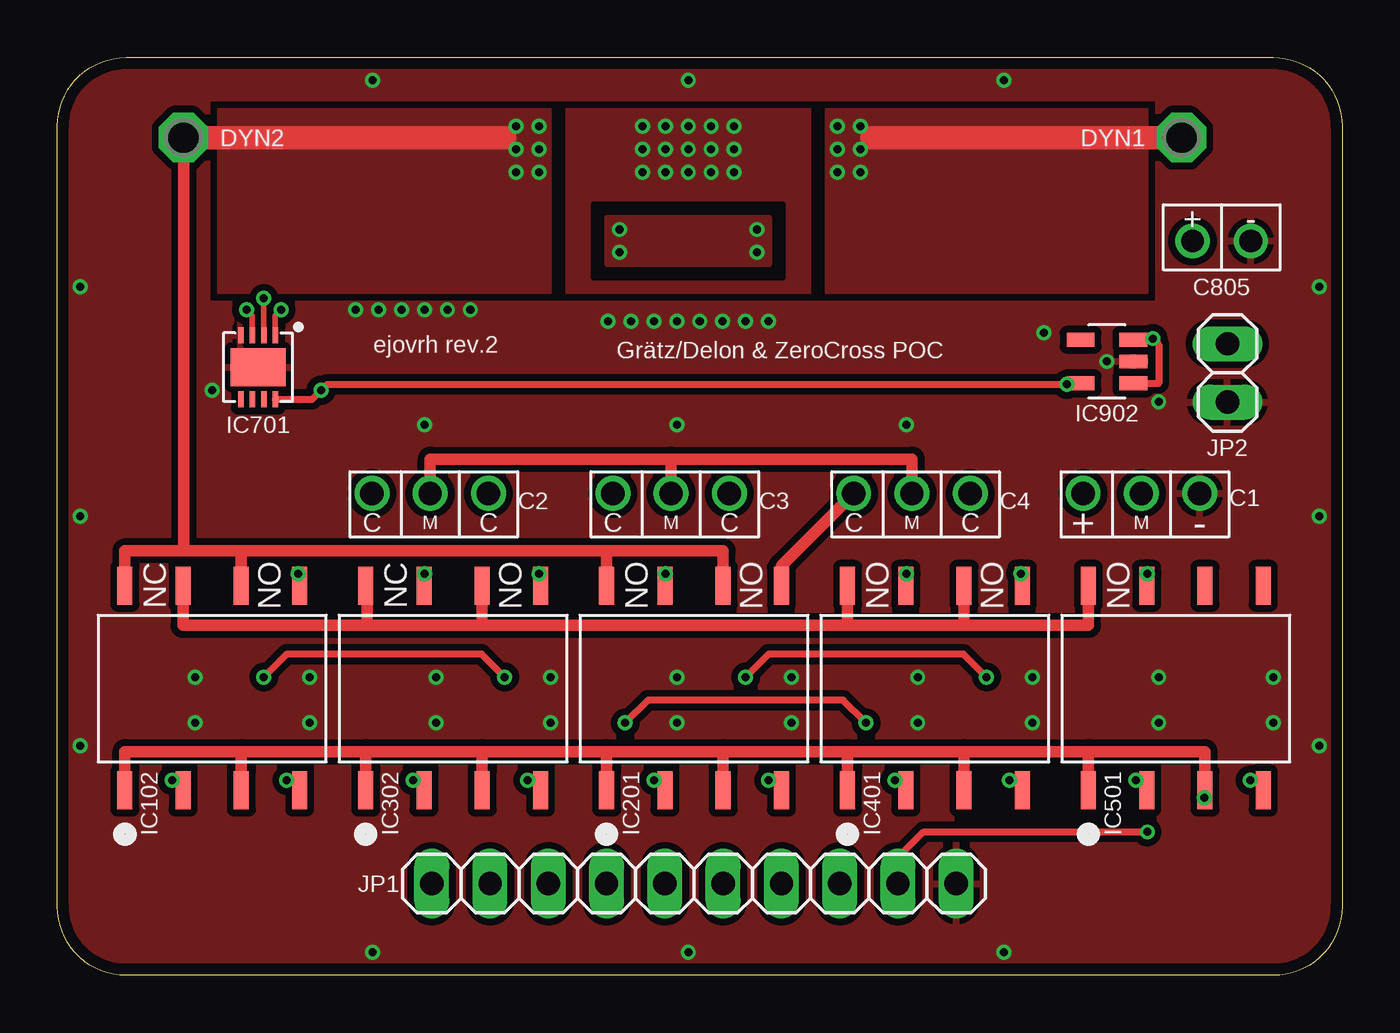
[diagram p9: board, top side]
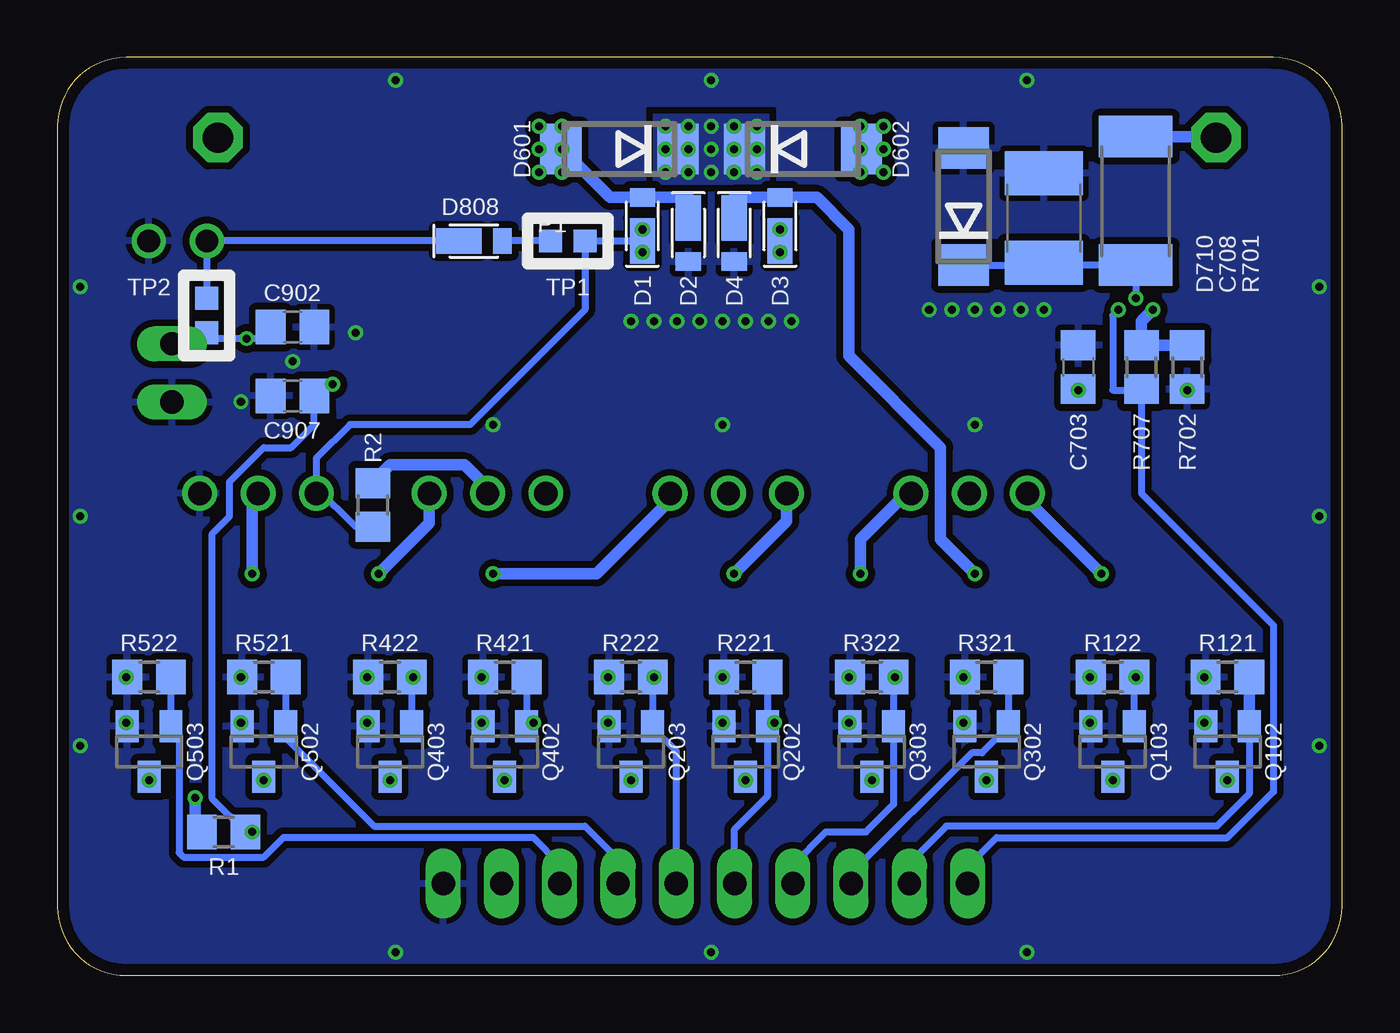
[diagram p10: board, bottom side, seen from below]

Size 56 x 40 mm. Coordinates in mm from the lower left corner, seen from the top.
Outline: 56,37 56,3 arc-90 53,0 3,0 arc-90 0,3 0,37 arc-90 3,40 53,40 arc-90 56,37
Copper layers (1*16): Top 0.035mm / dielectric 1.5mm / Bottom 0.035mm
Design rules "markovac_2layer": minimum track width 0.2mm, minimum drill 0.35mm, track to track 0.2mm, track to pad 0.2mm, pad to pad 0.2mm, via to via 0.2mm, smd to smd 0.2mm, copper to edge 0.5mm, drill to drill 8mil, minimum pad ring 0.15mm, minimum via ring 0.15mm, stop-mask expansion 4mil, vias tented up to drill 0.35mm, thermal gap 10mil

### Footprints (pad centres in the part's own frame; a part is rotated, then mirrored left to right if it is on the bottom)
TH-2S = drill 1.016: 1_POS -2.54,0; 2_MID 0,0; 3_NEG 2.54,0
TH-2S-BACK-TO-BACK = drill 1.016: 1_C -2.54,0; 2_MID 0,0; 3_C 2.54,0
C0805 = smd 1.3 x 1.5: 1 -0.95,0; 2 0.95,0
C1812 = smd 1.9 x 3.4: 1 -1.95,0; 2 1.95,0
TH = drill 1: NEG -1.27,0; POS 1.27,0
US2H = smd 2 x 1.1: A -1,0 | smd 0.8 x 1.1: C 0.9,0
DO214AA = smd 1.8 x 2.2: A 2.55,0; C -2.55,0
SMD_DIP8 = smd 0.65 x 1.65: 1_ANODE1 -3.81,-4.44; 2_CATHODE1 -1.27,-4.44; 3_ANODE2 1.27,-4.44; 4_CATHODE2 3.81,-4.44; 5_DRAIN2-1 3.81,4.48; 6_DRAIN2-2 1.27,4.48; 7_DRAIN1-1 -1.27,4.48; 8_DRAIN1-2 -3.81,4.48
DFN-8 = smd 0.25 x 0.7: 1_A_OUT -0.75,-1.4; 2_A_IN- -0.25,-1.4; 3_A_IN+ 0.25,-1.4; 4_V- 0.75,-1.4; 5_B_IN+ 0.75,1.4; 6_B_IN- 0.25,1.4; 7_B_OUT -0.25,1.4; 8_V+ -0.75,1.4 | smd 2.38 x 1.65: 9_V- 0,0
SOT-23-5L = smd 0.6 x 1.2: ADJ/NC -0.95,-1.15; EN -0.95,1.15; GND 0,1.15; IN 0.95,1.15; OUT 0.95,-1.15
1X10 = drill 1.016 long: 1 -11.43,0; 2 -8.89,0; 3 -6.35,0; 4 -3.81,0; 5 -1.27,0; 6 1.27,0; 7 3.81,0; 8 6.35,0; 9 8.89,0; 10 11.43,0
1X02 = drill 1.016 long: 1 -1.27,0; 2 1.27,0
SOT23 = smd 1 x 1.4: 1 -0.95,-1.1; 2 0.95,-1.1; 3 0,1.1
R0805 = smd 1.3 x 1.5: 1 -0.95,0; 2 0.95,0
R2512 = smd 1.8 x 3.2: 1 -2.8,0; 2 2.8,0
P1-13 = drill 1.321 pad 2.159 octagon: TP 0,0
TP10SQ = smd 1 x 1: TP 0,0

### Placement (x,y rotation side)
C1  47.25,21 0 top
C2  16.25,21 0 top
C3  26.75,21 0 top
C4  37.25,21 0 top
C703  0.1uF / 10V  [C0805]  11.5,26.5 270 bottom
C708  10nF / 100v  [C1812]  13,33 270 bottom
C805  2P 4700μF / 35V / ultralow ESR  [TH]  50.75,32 180 top
C902  1uF / 10V  [C0805]  45.75,28.25 0 bottom
C907  1uF / 10V  [C0805]  45.75,25.25 0 bottom
D1  30.5,33 90 bottom
D2  28.5,32 270 bottom
D3  24.5,33 90 bottom
D4  26.5,32 270 bottom
D601  19V/5W  [DO214AA]  31.5,36 180 bottom
D602  19V/5W  [DO214AA]  23.5,36 0 bottom
D710  6V/3W  [DO214AA]  16.5,33.5 90 bottom
D808  CUHS20S30,H3F  [US2H]  37.5,32 0 bottom
IC102  LBA710S  [SMD_DIP8]  6.75,12.5 0 top
IC201  LAA710S  [SMD_DIP8]  27.75,12.5 0 top
IC302  LBA710S  [SMD_DIP8]  17.25,12.5 0 top
IC401  LAA710S  [SMD_DIP8]  38.25,12.5 0 top
IC501  LAA710S  [SMD_DIP8]  48.75,12.5 0 top
IC701  LT1638IDD#PBF  [DFN-8]  8.75,26.5 180 top
IC902  LDK320AM33R  [SOT-23-5L]  45.75,26.75 270 top
JP1  27.75,4 0 top
JP2  51,26.25 270 top
Q102  IRLML2402TRPBF  [SOT23]  5,9.75 180 bottom
Q103  IRLML2402TRPBF  [SOT23]  10,9.75 180 bottom
Q202  IRLML2402TRPBF  [SOT23]  26,9.75 180 bottom
Q203  IRLML2402TRPBF  [SOT23]  31,9.75 180 bottom
Q302  IRLML2402TRPBF  [SOT23]  15.5,9.75 180 bottom
Q303  IRLML2402TRPBF  [SOT23]  20.5,9.75 180 bottom
Q402  IRLML2402TRPBF  [SOT23]  36.5,9.75 180 bottom
Q403  IRLML2402TRPBF  [SOT23]  41.5,9.75 180 bottom
Q502  IRLML2402TRPBF  [SOT23]  47,9.75 180 bottom
Q503  IRLML2402TRPBF  [SOT23]  52,9.75 180 bottom
R1  48.75,6.25 0 bottom
R2  42.25,20.5 270 bottom
R121  10k  [R0805]  5,13 180 bottom
R122  10k  [R0805]  10,13 180 bottom
R221  10k  [R0805]  26,13 180 bottom
R222  10k  [R0805]  31,13 180 bottom
R321  10k  [R0805]  15.5,13 180 bottom
R322  10k  [R0805]  20.5,13 180 bottom
R421  10k  [R0805]  36.5,13 180 bottom
R422  10k  [R0805]  41.5,13 180 bottom
R521  10k  [R0805]  47,13 180 bottom
R522  10k  [R0805]  52,13 180 bottom
R701  10k/3W  [R2512]  9,33.75 270 bottom
R702  10k  [R0805]  6.75,26.5 90 bottom
R707  10k  [R0805]  8.75,26.5 90 bottom
TP2  49,36.5 0 top
TP3  5.5,36.5 0 top
TP4  33,32 0 bottom
TP5  34.5,32 0 bottom
TP6  49.5,29.5 270 bottom
TP7  49.5,28 270 bottom

### Tracks (layer width: path | path; a pad name or v marks a point on that pad's centre or on a via)
+3V3  (via drill 0.35)
  Top 0.3: IC701.8_V+ 11.1,25.1 v11.5,25.5 11.75,25.75 v44,25.75 44.55,25.75 IC902.OUT | JP1.9 36.64,5.14 37.75,6.25 v47.5,6.25
  Bottom 0.3: v44,25.75 44.3,25.75 C907.2 44.8,24 45.8,23 47,23 48.5,21.5 48.5,20 49.25,19.25 49.25,7.7 R1.2 v47.5,6.25 | C703.2 v11.5,25.5
CAA  (via drill 0.35)
  Top 0.5: IC102.5_DRAIN2-1 10.5,17.04 v10.5,17.5
  Bottom 0.5: v10.5,17.5 13.71,20.71 C2.1_C
CAB  (via drill 0.35)
  Top 0.5: IC302.5_DRAIN2-1 21.06,17.44 v21,17.5
  Bottom 0.5: C2.3_C 19,21 21,19 v21,17.5
CBA  (via drill 0.35)
  Top 0.5: IC201.7_DRAIN1-1 26.48,17.48 v26.5,17.5
  Bottom 0.5: v26.5,17.5 24.21,19.79 C3.1_C
CBB  (via drill 0.35)
  Top 0.5: IC401.7_DRAIN1-1 36.98,17.48 v37,17.5
  Bottom 0.5: C3.3_C 29.29,20.71 32.5,17.5 v37,17.5
CCA
  Top 0.5: IC201.5_DRAIN2-1 31.56,17.85 C4.1_C
CCB  (via drill 0.35)
  Top 0.5: IC401.5_DRAIN2-1 42,17.04 v42,17.5
  Bottom 0.5: v42,17.5 39.79,19.71 C4.3_C
DYNAMO1  (via drill 0.35)
  Top 0.5: 35.5,36.5 v35,37
  Top 1.016: TP2.TP 35.5,36.5
  Bottom 0.5: D2.A 28.5,33.9 D1.C 31.9,33.9 v34,36 D601.A
  other vias: 34,37 34,35 35,35 35,36
  pour Top (isolate 0.3, no thermals): 33.5,37.75 47.5,37.75 47.5,29.75 33.5,29.75
DYNAMO2_AFTER_TUNING-CAP_SW
  Top 0.5: IC102.7_DRAIN1-1 5.48,15.25 13.5,15.25 | IC501.8_DRAIN1-2 44.94,15.25 39.52,15.25 | 13.5,15.25 18.52,15.25 | 18.52,15.25 34.44,15.25 | 34.44,15.25 39.52,15.25 | IC401.6_DRAIN2-2 39.52,15.25 | IC401.8_DRAIN1-2 34.44,15.25 | IC302.8_DRAIN1-2 13.5,16.98 13.5,15.25 | IC302.6_DRAIN2-2 18.52,15.25
DYNAMO2_BEFORE_TUNING-CAP_SW  (via drill 0.35)
  Top 0.5: 19.5,36.5 v20,37 | 8.02,18.5 5.5,18.5 | IC102.8_DRAIN1-2 2.94,18.5 5.5,18.5 | IC102.6_DRAIN2-2 8.02,18.5 | IC201.8_DRAIN1-2 23.94,18.5 | 23.94,18.5 8.02,18.5 | IC201.6_DRAIN2-2 29.02,18.5 23.94,18.5 | TP3.TP 5.5,18.5
  Top 1.016: TP3.TP 19.5,36.5
  Bottom 0.5: TP3.TP 5.55,36.55 R701.1 | D602.A v21,36
  other vias: 21,37 20,35 21,35 20,36
  pour Top (isolate 0.3, no thermals): 21.5,37.75 7,37.75 7,29.75 21.5,29.75
DYNAMO2_DELON  (via drill 0.35)
  Top 0.5: IC501.7_DRAIN1-1 47.5,17 v47.5,17.5
  Bottom 0.5: C1.2_MID 47.5,20.75 v47.5,17.5
DYNAMO2_GRAETZ  (via drill 0.35)
  Top 0.5: v16,17.5 16,17 IC302.7_DRAIN1-1
  Bottom 0.5: D4.A 26.5,33.9 D3.C 22.9,33.9 21.5,32.5 21.5,27 17.5,23 17.5,19 v16,17.5
GND  (via drill 0.35)
  Bottom 0.5: Q302.2 16.45,10.95 v16.5,11
  other vias: 45.75,26.75 27.5,1 27.5,39 1,20 1,30 1,10 13.75,1 41.25,39 41.25,1 55,10 55,20 55,30 13.75,39 48,25 43,28 24,28.5 25,28.5 26,28.5 27,28.5 28,28.5 29,28.5 30,28.5 31,28.5 6.75,25.5 15,29 13,29 14,29 16,29 17,29 18,29 6,13 11,13 16.5,13 21.5,13 27,13 32,13 37.5,13 42.5,13 48,13 21.5,11 27,11 32,11 37.5,11 42.5,11 48,11 53,11 53,13 6,11 11,11 16,24 27,24 37,24
  pour Top (isolate 0.3, rank 3): 0,40 56,40 56,0 0,0
  pour Bottom (isolate 0.3, rank 2): 0,40 56,40 56,0 0,0
N$1
  Bottom 0.3: R522.1 Q503.1 50.7,10.5 50.7,5.36 50.49,5.15 47.01,5.15 46.16,6 35.25,6 34.1,4.85 JP1.8
OVP:ZENER_COMMON  (via drill 0.35)
  other vias: 27.5,37 27.5,36 27.5,35 26.5,35 26.5,36 26.5,37 25.5,37 25.5,36 25.5,35 28.5,35 28.5,36 28.5,37 29.5,37 29.5,36 29.5,35
  pour Bottom (isolate 0.3, no thermals): 25,37.5 30,37.5 30,34.5 25,34.5
  pour Top (isolate 0.61, rank 2, no thermals): 19.5,37.75 35.5,37.75 35.5,29.75 19.5,29.75
SSR_ANODE  (via drill 0.35)
  Top 0.5: IC102.1_ANODE1 2.94,9.75 8.02,9.75 | 8.02,9.75 13.44,9.75 | 13.44,9.75 18.52,9.75 | 18.52,9.75 23.94,9.75 | 23.94,9.75 29.02,9.75 | 29.02,9.75 34.44,9.75 | 34.44,9.75 39.52,9.75 | 39.52,9.75 44.94,9.75 | 44.94,9.75 50.02,9.75 IC501.3_ANODE2 50.02,7.77 v50,7.75 | IC501.1_ANODE1 44.94,9.75 | IC401.3_ANODE2 39.52,9.75 | IC201.3_ANODE2 29.02,9.75 | IC401.1_ANODE1 34.44,9.75 | IC201.1_ANODE1 23.94,9.75 | IC302.3_ANODE2 18.52,9.75 | IC302.1_ANODE1 13.44,9.75 | IC102.3_ANODE2 8.02,9.75
  Bottom 0.5: R1.1 50,6.55 v50,7.75
SSR_NC/NO1:SW1_CAT  (via drill 0.35)
  Top 0.3: v5,8.5 5.48,8.5 IC102.2_CATHODE1
  Bottom 0.3: Q102.3 v5,8.5
SSR_NC/NO1:SW2_CAT  (via drill 0.35)
  Top 0.3: v10,8.5 10.56,8.5 IC102.4_CATHODE2
  Bottom 0.3: Q103.3 v10,8.5
SSR_NC/NO2:SW1_CAT  (via drill 0.35)
  Top 0.3: v15.5,8.5 15.98,8.5 IC302.2_CATHODE1
  Bottom 0.3: Q302.3 v15.5,8.5
SSR_NC/NO2:SW2_CAT  (via drill 0.35)
  Top 0.3: v20.5,8.5 21.06,8.5 IC302.4_CATHODE2
  Bottom 0.3: Q303.3 v20.5,8.5
SSR_NO/NO1:SW1_CAT  (via drill 0.35)
  Top 0.3: v26,8.5 26.48,8.5 IC201.2_CATHODE1
  Bottom 0.3: Q202.3 v26,8.5
SSR_NO/NO1:SW2_CAT  (via drill 0.35)
  Top 0.3: v31,8.5 31.56,8.5 IC201.4_CATHODE2
  Bottom 0.3: Q203.3 v31,8.5
SSR_NO/NO2:SW1_CAT  (via drill 0.35)
  Top 0.3: v36.5,8.5 36.98,8.5 IC401.2_CATHODE1
  Bottom 0.3: Q402.3 v36.5,8.5
SSR_NO/NO2:SW2_CAT  (via drill 0.35)
  Top 0.3: v41.5,8.5 42.06,8.5 IC401.4_CATHODE2
  Bottom 0.3: Q403.3 v41.5,8.5
SSR_NO/NO3:SW1_CAT  (via drill 0.35)
  Top 0.3: v47,8.5 47.48,8.5 IC501.2_CATHODE1
  Bottom 0.3: Q502.3 v47,8.5
SSR_NO/NO3:SW2_CAT  (via drill 0.35)
  Top 0.3: v52,8.5 52.56,8.5 IC501.4_CATHODE2
  Bottom 0.3: Q503.3 v52,8.5
SW1_CTRL
  Bottom 0.3: Q102.1 4.05,7.91 5.46,6.5 17.25,6.5 18.86,4.89 JP1.2
  Bottom 0.5: Q102.1 R121.1
SW2_CTRL
  Bottom 0.3: R321.1 Q302.1 15.7,9.7 16.14,9.7 21.4,4.45 JP1.3
SW9_CTRL
  Bottom 0.3: R521.1 Q502.1 46.05,10.35 42.2,6.5 33,6.5 31.56,5.06 JP1.7
SW_CA_CTRL  (via drill 0.35)
  Top 0.3: v9,13 10,14 18.5,14 v19.5,13
  Bottom 0.3: Q103.1 R122.1 v9,13 | v19.5,13 R322.1 Q303.1 19.55,7.45 20.75,6.25 22.5,6.25 23.94,4.81 JP1.4
SW_CB_CTRL  (via drill 0.35)
  Top 0.3: v35.25,11 34.25,12 25.75,12 v24.75,11
  Bottom 0.3: R221.1 Q202.1 | R421.1 Q402.1 35.4,11 v35.25,11 | Q202.1 24.9,11 v24.75,11 | Q202.1 25.05,7.8 26.48,6.37 JP1.5
SW_CC_CTRL  (via drill 0.35)
  Top 0.3: v30,13 31,14 39.5,14 v40.5,13
  Bottom 0.3: Q403.1 R422.1 v40.5,13 | v30,13 R222.1 Q203.1 30.05,10.8 29.02,9.77 JP1.6
TUNING_CAP_BIAS
  Top 0.5: C2.2_MID 16.25,22.5 26.75,22.5 | C4.2_MID 37.25,22.5 26.75,22.5 | C3.2_MID 26.75,22.5
  Bottom 0.5: C4.2_MID 37.25,21.25 38.25,22.25 41.5,22.25 42.25,21.5 R2.1
V_RECT_TP1-IN  (via drill 0.35)
  Bottom 0.3: 44.71,21.25 C1.1_POS | R2.2 43.01,19.55 44.71,21.25 | 44.71,21.25 44.71,22.54 43.25,24 38,24 33,29 TP4.TP D1.A v30.5,31.5 | D3.A v24.5,31.5
  Bottom 0.5: 24.45,31.95 D3.A
  other vias: 24.5,32.5 30.5,32.5
  pour Top (no thermals): 24,33 31,33 31,31 24,31
V_RECT_TP1-OUT
  Bottom 0.3: TP5.TP D808.C
V_REGULATED_TP2-IN
  Bottom 0.3: D808.A C805.POS 49.48,29.52 TP6.TP
V_REGULATED_TP2-OUT  (via drill 0.35)
  Top 0.3: IC902.EN 46.9,27.75 v47.75,27.75 48,27.5 48,25.8 IC902.IN
  Bottom 0.3: C902.1 46.75,28.2 46.75,27.75 v47.75,27.75 49.25,27.75 TP7.TP 49.98,27.52 JP2.1
ZERO-CROSS_DETECTOR:N$6  (via drill 0.35)
  Top 0.25: v9,29.5 IC701.2_A_IN-
  Bottom 0.3: D710.C 13,30.95 | C708.2 13,30.95 | 13,30.95 R701.2 v9,29.5
ZERO-CROSS_DETECTOR:N$12  (via drill 0.35)
  Top 0.25: IC701.3_A_IN+ 8.5,28.75 v8.25,29
  Bottom 0.5: R702.2 R707.2 8.75,28.5 v8.25,29
ZEROCROSS  (via drill 0.35)
  Top 0.25: IC701.1_A_OUT 9.5,28.75 v9.75,29
  Bottom 0.3: v9.75,29 10,28.75 10,25.5 8.75,25.5 R707.1 8.75,21 3,15.25 3,8 5,6 15.07,6 16.32,4.75 JP1.1

### Text on the board
tPlace: DYN2 | DYN1 | ejovrh rev.2 | Grätz/Delon & ZeroCross POC | NC | NO | NC | NO | NO | NO | NO | NO | NO
bPlace: TP1 | TP1 | TP2